# EAGLE design itrope-Hive-pairs (EAGLE 7.7.0)

## Sheet 1 of 9
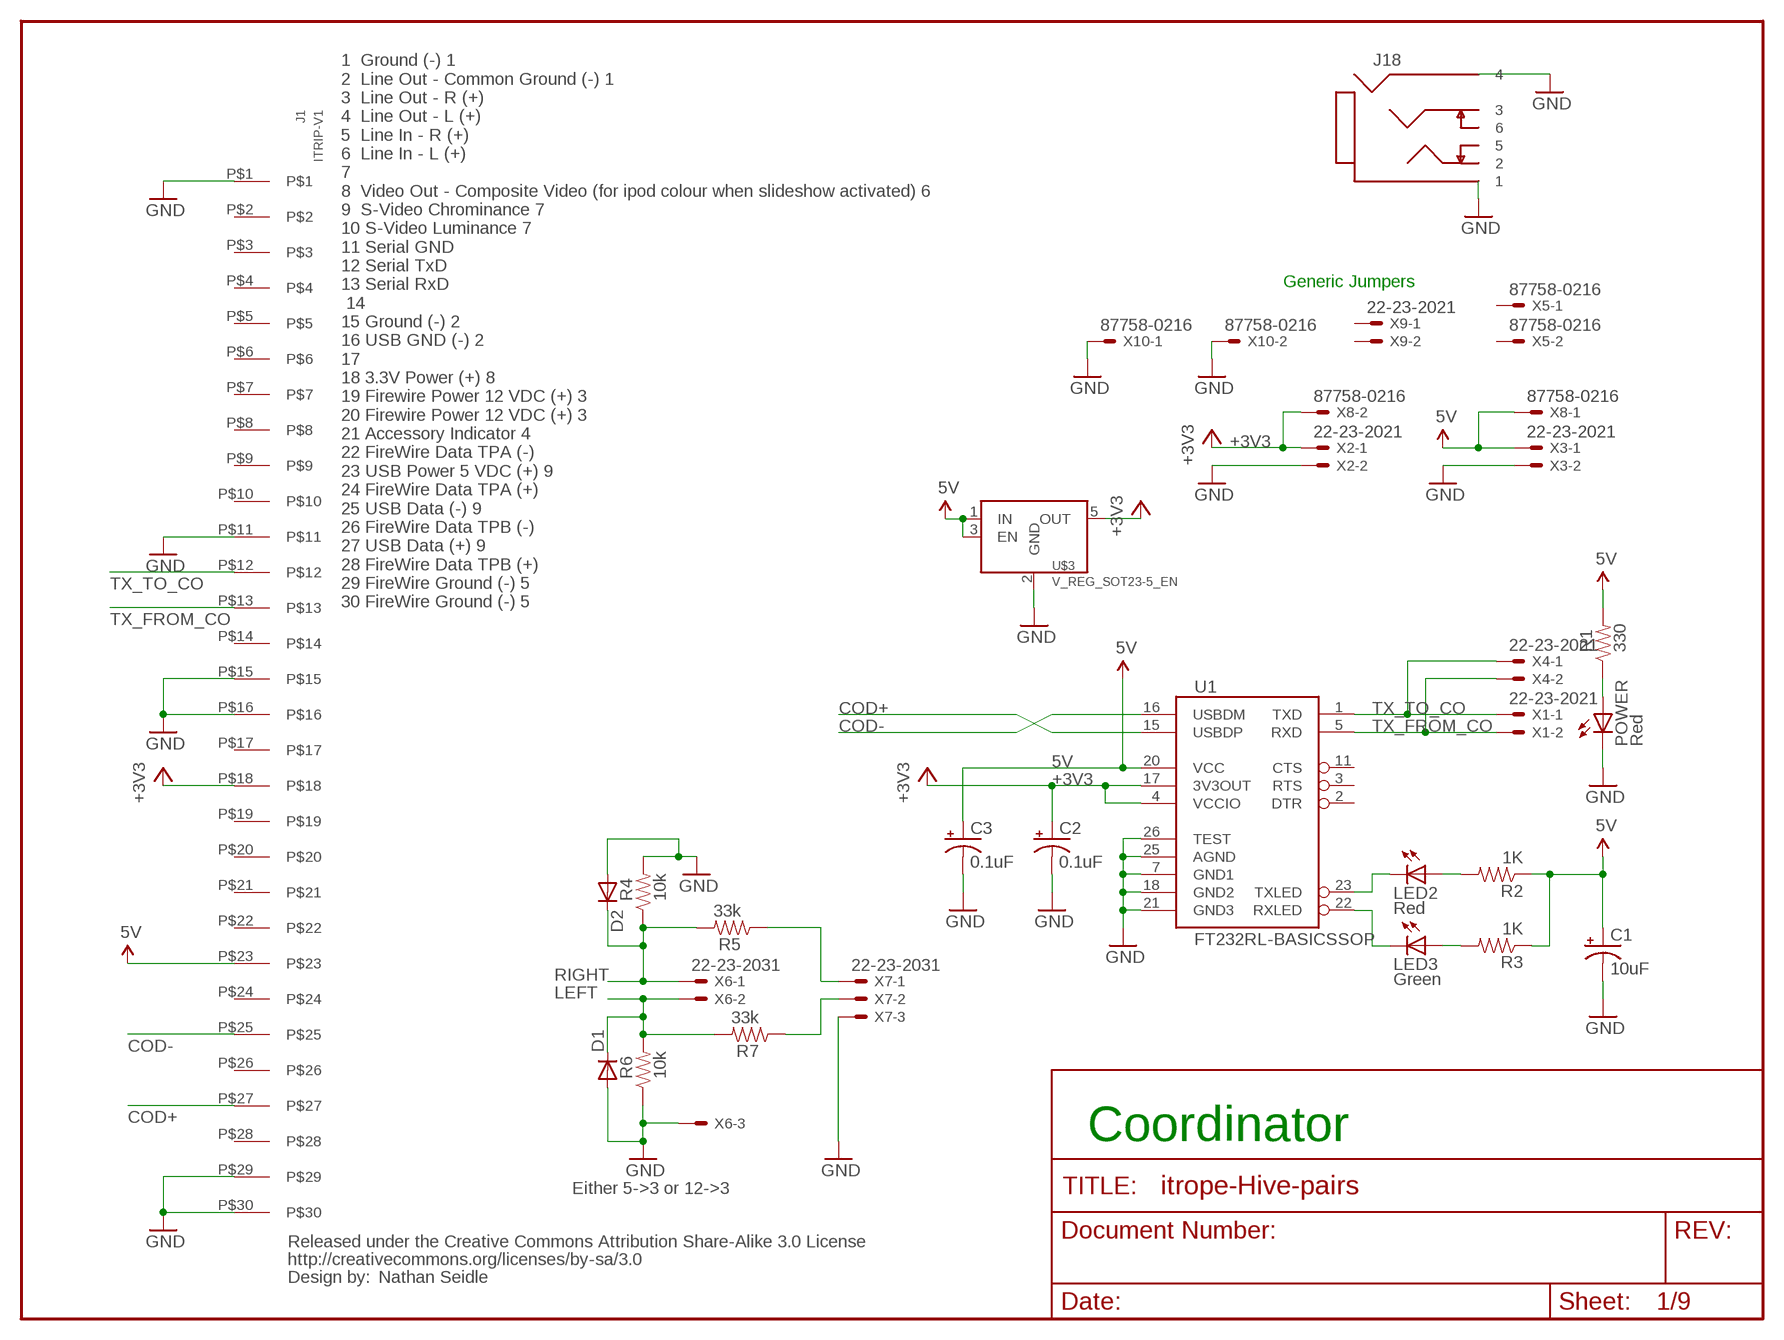
[diagram p0: schematic, sheet 1]

### Parts
C1  10uF  CPOL-USE2.5-5  [E2,5-5]
C2  0.1uF  CPOL-USE2.5-5  [E2,5-5]
C3  0.1uF  CPOL-USE2.5-5  [E2,5-5]
D1  DIODESOD  [SOD-323]
D2  DIODESOD  [SOD-323]
J1  ITRIP-V1  [30PINEDGE+ITRIP]
J18  JACK-PHONO-4COND-SW-C  [CUI-SJ-4351-CUSTOM]
LED2  Red  LED0603  [LED-0603]
LED3  Green  LED0603  [LED-0603]
POWER  Red  LED0603  [LED-0603]
R1  330  RESISTOR0402  [C0402]
R2  1K  RESISTOR0402  [C0402]
R3  1K  RESISTOR0402  [C0402]
R4  10k  RESISTOR0402  [C0402]
R5  33k  RESISTOR0402  [C0402]
R6  10k  RESISTOR0402  [C0402]
R7  33k  RESISTOR0402  [C0402]
U1  FT232RL-BASICSSOP  [SSOP28DB]
U$3  V_REG_SOT23-5_EN  [SOT23-5]
U$9  CREATIVE_COMMONS  [CREATIVE_COMMONS]
X1  22-23-2021  [22-23-2021]
X2  22-23-2021  [22-23-2021]
X3  22-23-2021  [22-23-2021]
X4  22-23-2021  [22-23-2021]
X5  87758-0216  [87758-0216]
X6  22-23-2031  [22-23-2031]
X7  22-23-2031  [22-23-2031]
X8  87758-0216  [87758-0216]
X9  22-23-2021  [22-23-2021]
X10  87758-0216  [87758-0216]

### Nets
5V [vcc]: C1.+ C3.+ J1.P$23 R1.2 R2.1 R3.1 U1.20(VCC) U$3.1(IN) U$3.3(EN) X3.1 X8.1 ; also sheet 2,3,4,5,6,7,8,9
+3V3: C2.+ J1.P$18 U1.4(VCCIO) U1.17(3V3OUT) U$3.5(OUT) X2.1 X8.2 ; also sheet 2,3,4,5,6,7,8,9
COD+: J1.P$27 U1.15(USBDP)
COD-: J1.P$25 U1.16(USBDM)
GND [vcc]: C1.- C2.- C3.- D1.2(A) D2.2(A) J1.P$1 J1.P$11 J1.P$15 J1.P$16 J1.P$29 J1.P$30 J18.1 J18.4 POWER.C R4.2 R6.1 U1.7(GND1) U1.18(GND2) U1.21(GND3) U1.25(AGND) U1.26(TEST) U$3.2(GND) X2.2 X3.2 X6.3 X7.3 X10.1 X10.2 ; also sheet 2,3,4,5,6,7,8,9
LEFT: D1.1(C) R6.2 R7.2 X6.2 ; also sheet 2,3,4,5,6,7,8,9
N$1: POWER.A R1.1
N$2: R7.1 X7.2
N$3: LED2.A R2.2
N$4: LED3.A R3.2
N$5: R5.1 X7.1
RIGHT: D2.1(C) R4.1 R5.2 X6.1 ; also sheet 2,3,4,5,6,7,8,9
RXLED: LED3.C U1.22(RXLED)
TX_FROM_CO: J1.P$13 U1.5(RXD) X1.2 X4.2 ; also sheet 2
TX_TO_CO: J1.P$12 U1.1(TXD) X1.1 X4.1 ; also sheet 2
TXLED: LED2.C U1.23(TXLED)
Unconnected: J1.P$2 J1.P$3 J1.P$4 J1.P$5 J1.P$6 J1.P$7 J1.P$8 J1.P$9 J1.P$10 J1.P$14 J1.P$17 J1.P$19 J1.P$20 J1.P$21 J1.P$22 J1.P$24 J1.P$26 J1.P$28 J18.2 J18.3 J18.5 J18.6 U1.2(DTR) U1.3(RTS) U1.11(CTS) X5.1 X5.2 X9.1 X9.2

### Notes on the sheet
- Generic Jumpers
- 1  Ground (-) 1
  2  Line Out - Common Ground (-) 1
  3  Line Out - R (+)
  4  Line Out - L (+)
  5  Line In - R (+)
  6  Line In - L (+)
  7
  8  Video Out - Composite Video (for ipod colour when slideshow activated) 6
  9  S-Video Chrominance 7
  10 S-Video Luminance 7
  11 Serial GND
  12 Serial TxD
  13 Serial RxD
   14
  15 Ground (-) 2
  16 USB GND (-) 2
  17
  18 3.3V Power (+) 8
  19 Firewire Power 12 VDC (+) 3
  20 Firewire Power 12 VDC (+) 3
  21 Accessory Indicator 4
  22 FireWire Data TPA (-)
  23 USB Power 5 VDC (+) 9
  24 FireWire Data TPA (+)
  25 USB Data (-) 9
  26 FireWire Data TPB (-)
  27 USB Data (+) 9
  28 FireWire Data TPB (+)
  29 FireWire Ground (-) 5
  30 FireWire Ground (-) 5
- Coordinator
- Either 5->3 or 12->3
- Nathan Seidle

## Sheet 2 of 9
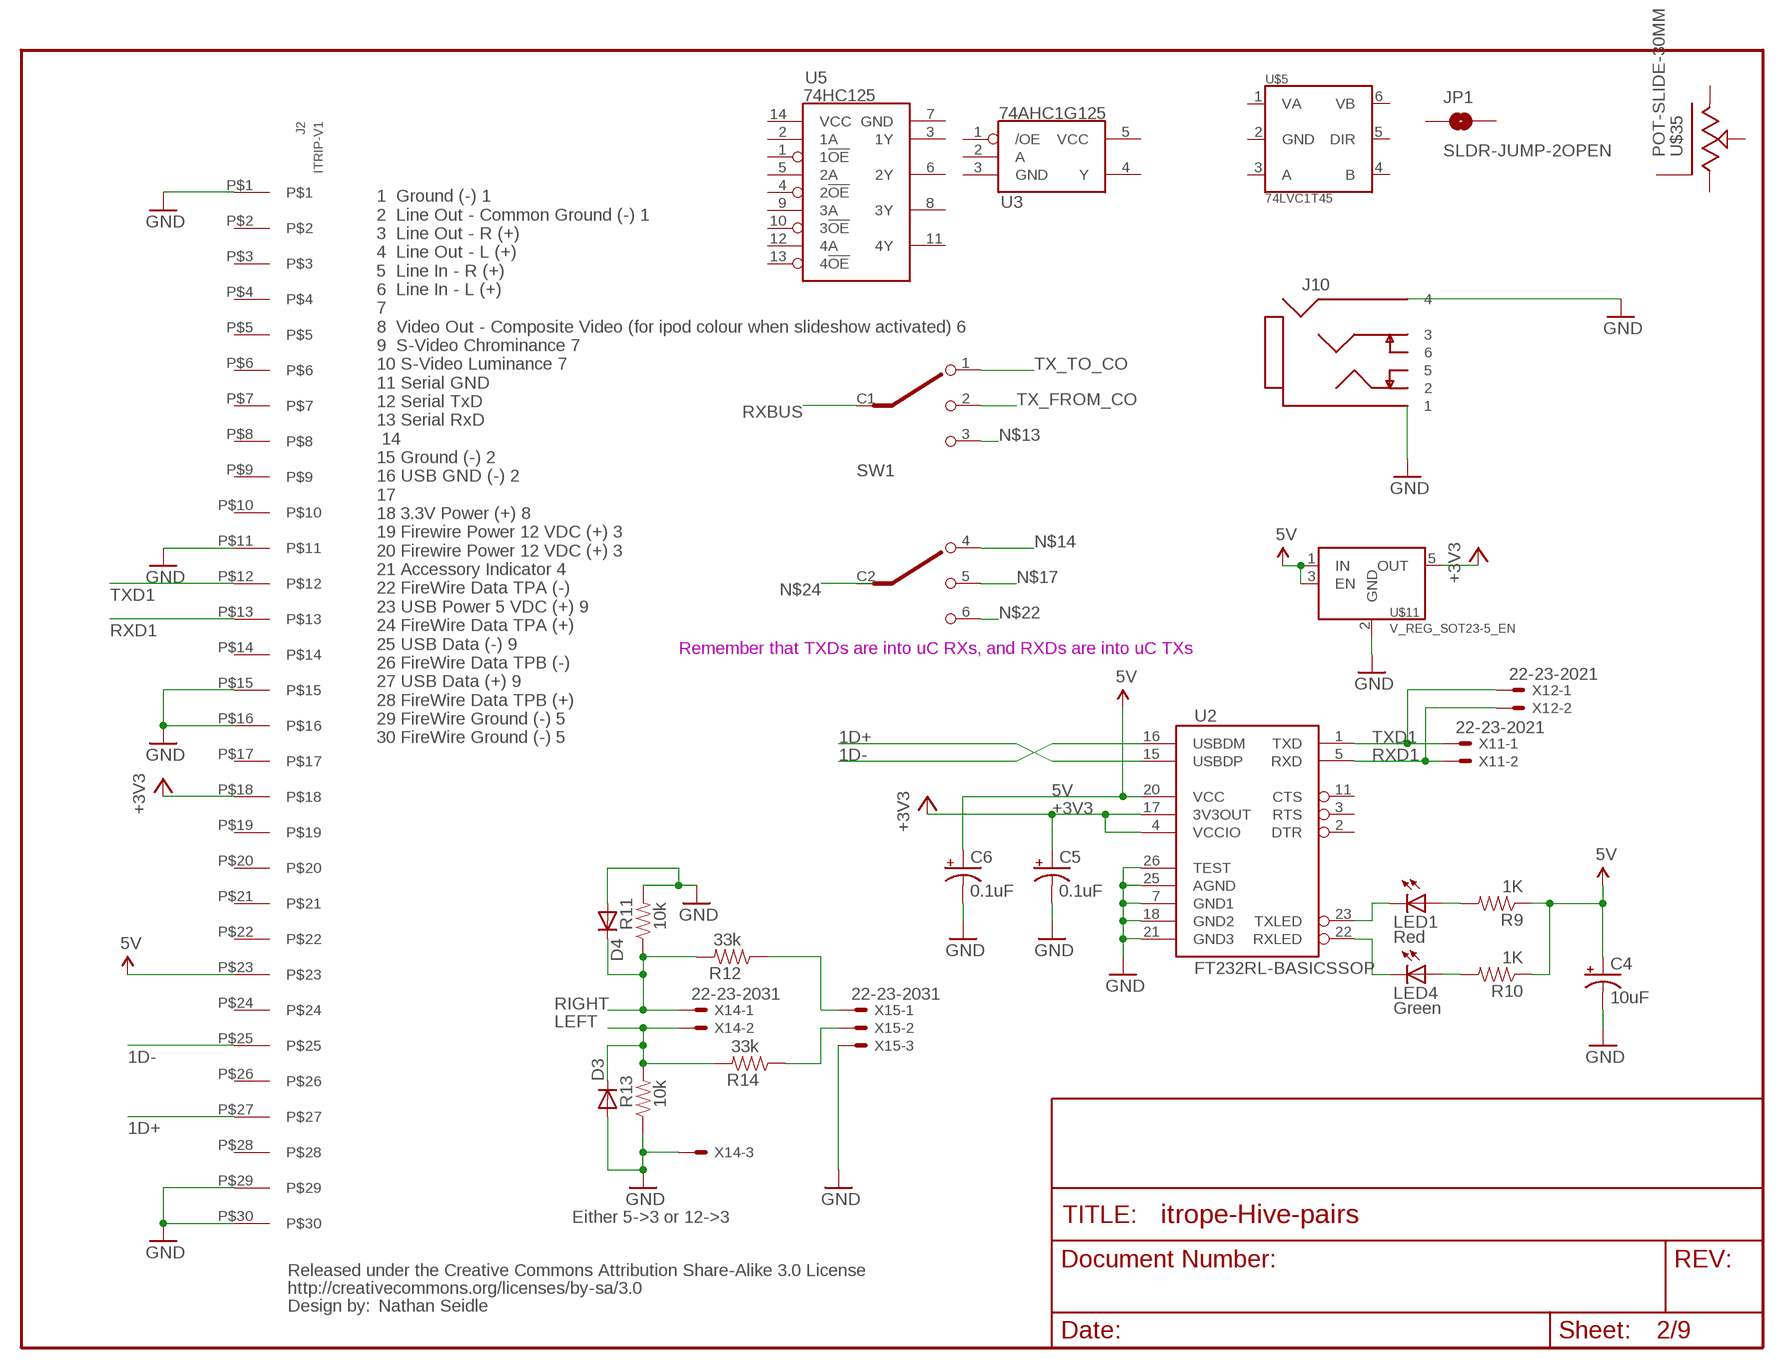
[diagram p1: schematic, sheet 2]

### Parts
C4  10uF  CPOL-USE2.5-5  [E2,5-5]
C5  0.1uF  CPOL-USE2.5-5  [E2,5-5]
C6  0.1uF  CPOL-USE2.5-5  [E2,5-5]
D3  DIODESOD  [SOD-323]
D4  DIODESOD  [SOD-323]
J2  ITRIP-V1  [30PINEDGE+ITRIP]
J10  JACK-PHONO-4COND-SW-C  [CUI-SJ-4351-CUSTOM]
JP1  SLDR-JUMP-2OPEN  [PAD-JUMPER-2-NO_YES_SILK]
LED1  Red  LED0603  [LED-0603]
LED4  Green  LED0603  [LED-0603]
R9  1K  RESISTOR0402  [C0402]
R10  1K  RESISTOR0402  [C0402]
R11  10k  RESISTOR0402  [C0402]
R12  33k  RESISTOR0402  [C0402]
R13  10k  RESISTOR0402  [C0402]
R14  33k  RESISTOR0402  [C0402]
SW1  SWITCH-SLIDE-DP3TAYZ0203  [SWITCH-CK-AYZ0203]
U2  FT232RL-BASICSSOP  [SSOP28DB]
U3  74AHC1G125  [SOT23-5]
U5  74HC125  [SOIC14]
U$5  74LVC1T45  [SC70-6]
U$7  CREATIVE_COMMONS  [CREATIVE_COMMONS]
U$11  V_REG_SOT23-5_EN  [SOT23-5]
U$35  POT-SLIDE-30MM  [POT-SLIDE-30MM]
X11  22-23-2021  [22-23-2021]
X12  22-23-2021  [22-23-2021]
X14  22-23-2031  [22-23-2031]
X15  22-23-2031  [22-23-2031]

### Nets
1D+: J2.P$27 U2.15(USBDP)
1D-: J2.P$25 U2.16(USBDM)
5V [vcc]: C4.+ C6.+ J2.P$23 R9.1 R10.1 U2.20(VCC) U$11.1(IN) U$11.3(EN) ; also sheet 1,3,4,5,6,7,8,9
+3V3: C5.+ J2.P$18 U2.4(VCCIO) U2.17(3V3OUT) U$11.5(OUT) ; also sheet 1,3,4,5,6,7,8,9
GND [vcc]: C4.- C5.- C6.- D3.2(A) D4.2(A) J2.P$1 J2.P$11 J2.P$15 J2.P$16 J2.P$29 J2.P$30 J10.1 J10.4 R11.2 R13.1 U2.7(GND1) U2.18(GND2) U2.21(GND3) U2.25(AGND) U2.26(TEST) U$11.2(GND) X14.3 X15.3 ; also sheet 1,3,4,5,6,7,8,9
LEFT: D3.1(C) R13.2 R14.2 X14.2 ; also sheet 1,3,4,5,6,7,8,9
N$8: LED1.A R9.2
N$9: LED4.A R10.2
N$10: R14.1 X15.2
N$11: R12.1 X15.1
N$13: SW1.3
N$14: SW1.4
N$17: SW1.5
N$22: SW1.6
RIGHT: D4.1(C) R11.1 R12.2 X14.1 ; also sheet 1,3,4,5,6,7,8,9
RXBUS: SW1.C1
RXD1: J2.P$13 U2.5(RXD) X11.2 X12.2 ; also sheet 3
RXLED1: LED4.C U2.22(RXLED)
TX_FROM_CO: SW1.2 ; also sheet 1
TX_TO_CO: SW1.1 ; also sheet 1
TXD1: J2.P$12 U2.1(TXD) X11.1 X12.1 ; also sheet 3
TXLED1: LED1.C U2.23(TXLED)
Unconnected: J2.P$2 J2.P$3 J2.P$4 J2.P$5 J2.P$6 J2.P$7 J2.P$8 J2.P$9 J2.P$10 J2.P$14 J2.P$17 J2.P$19 J2.P$20 J2.P$21 J2.P$22 J2.P$24 J2.P$26 J2.P$28 J10.2 J10.3 J10.5 J10.6 JP1.1 JP1.2 SW1.C2 U2.2(DTR) U2.3(RTS) U2.11(CTS) U3.1(/OE) U3.2(A) U3.3(GND) U3.4(Y) U3.5(VCC) U5.1(1!OE) U5.2(1A) U5.3(1Y) U5.4(2!OE) U5.5(2A) U5.6(2Y) U5.7(GND) U5.8(3Y) U5.9(3A) U5.10(3!OE) U5.11(4Y) U5.12(4A) U5.13(4!OE) U5.14(VCC) U$5.1(VA) U$5.2(GND) U$5.3(A) U$5.4(B) U$5.5(DIR) U$5.6(VB) U$35.1 U$35.2 U$35.3 U$35.P$4(CASE) U$35.P$5(CASE) U$35.P$6(CASE) U$35.P$7(CASE)

### Notes on the sheet
- Remember that TXDs are into uC RXs, and RXDs are into uC TXs
- 1  Ground (-) 1
  2  Line Out - Common Ground (-) 1
  3  Line Out - R (+)
  4  Line Out - L (+)
  5  Line In - R (+)
  6  Line In - L (+)
  7
  8  Video Out - Composite Video (for ipod colour when slideshow activated) 6
  9  S-Video Chrominance 7
  10 S-Video Luminance 7
  11 Serial GND
  12 Serial TxD
  13 Serial RxD
   14
  15 Ground (-) 2
  16 USB GND (-) 2
  17
  18 3.3V Power (+) 8
  19 Firewire Power 12 VDC (+) 3
  20 Firewire Power 12 VDC (+) 3
  21 Accessory Indicator 4
  22 FireWire Data TPA (-)
  23 USB Power 5 VDC (+) 9
  24 FireWire Data TPA (+)
  25 USB Data (-) 9
  26 FireWire Data TPB (-)
  27 USB Data (+) 9
  28 FireWire Data TPB (+)
  29 FireWire Ground (-) 5
  30 FireWire Ground (-) 5
- Either 5->3 or 12->3
- Nathan Seidle

## Sheet 3 of 9
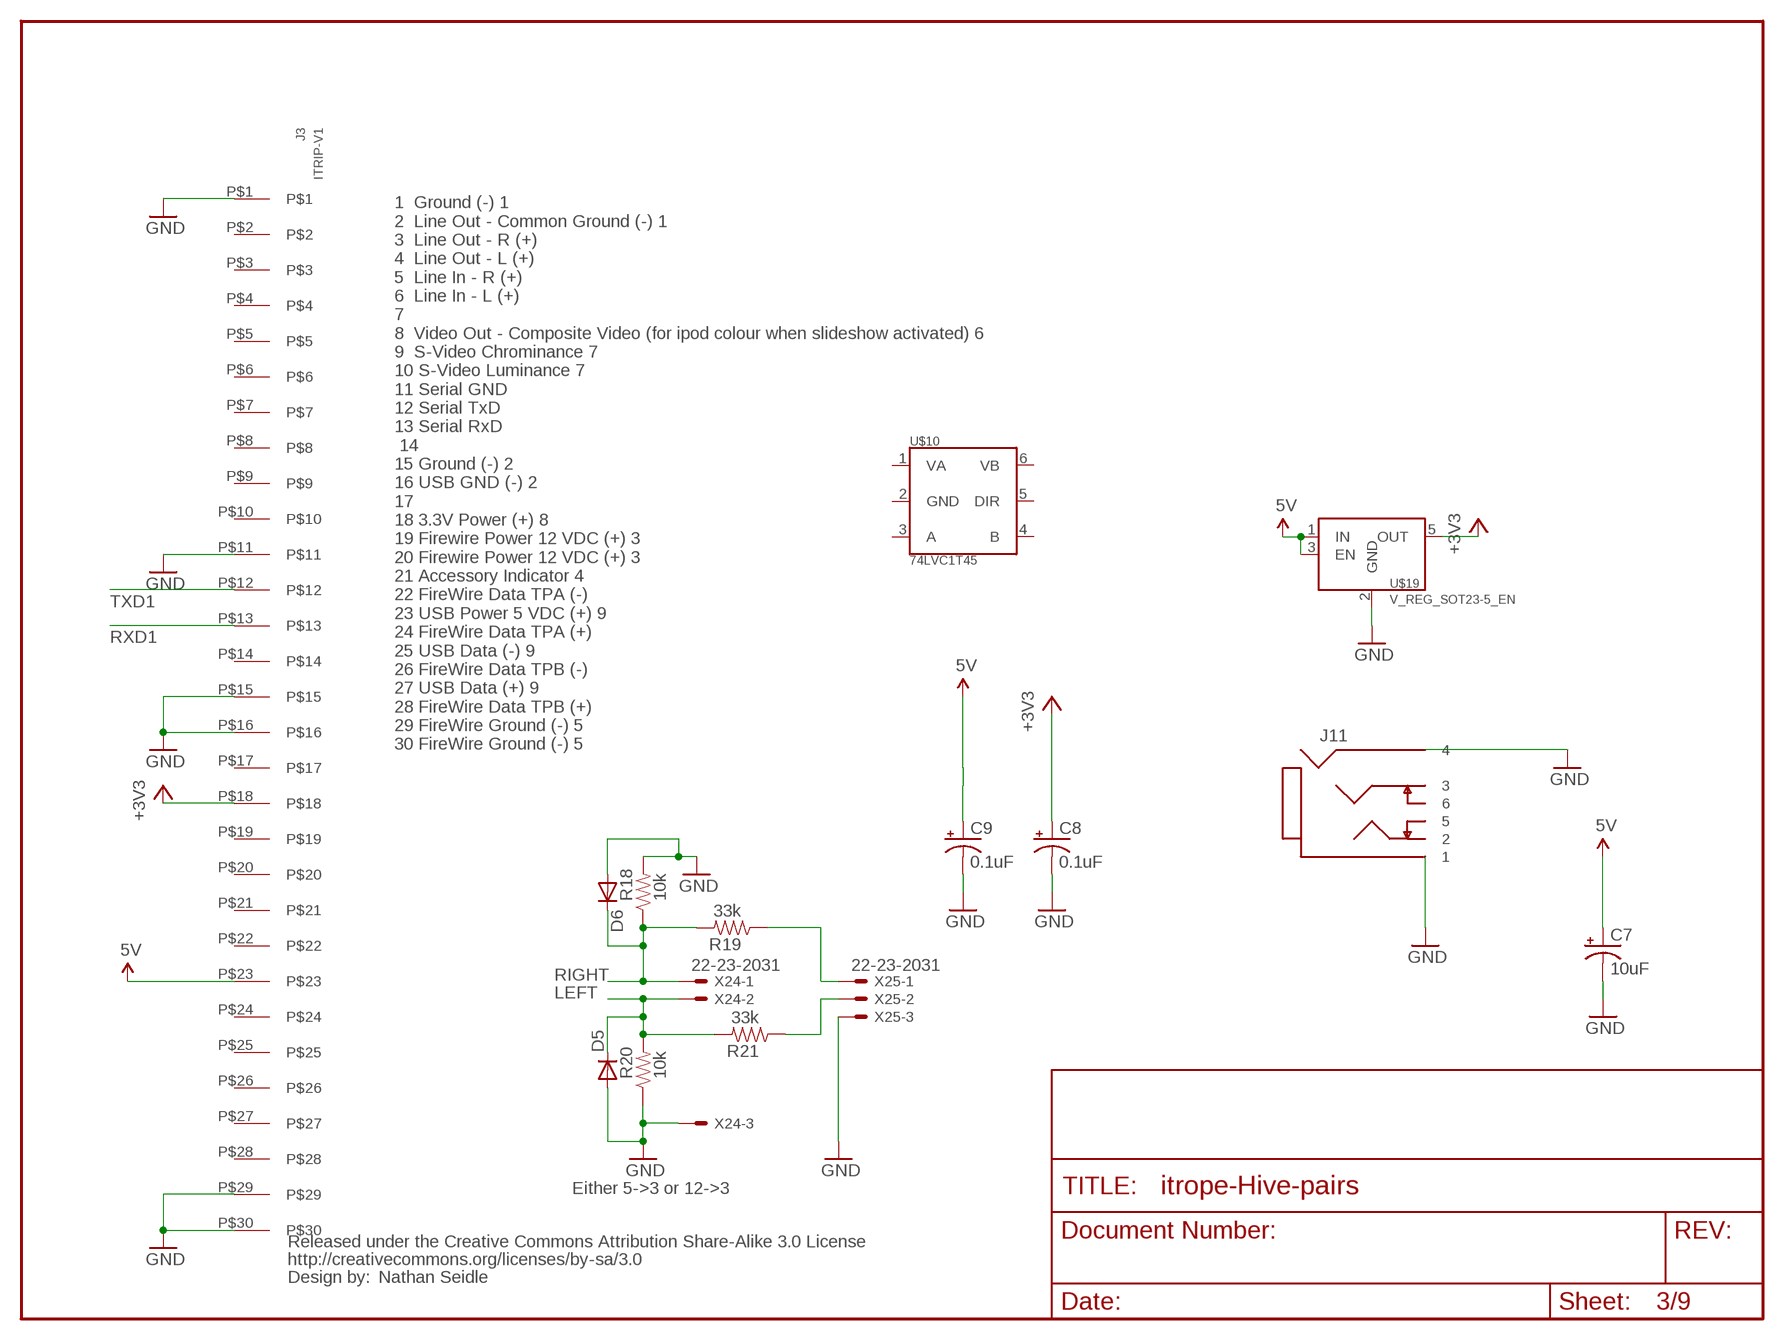
[diagram p2: schematic, sheet 3]

### Parts
C7  10uF  CPOL-USE2.5-5  [E2,5-5]
C8  0.1uF  CPOL-USE2.5-5  [E2,5-5]
C9  0.1uF  CPOL-USE2.5-5  [E2,5-5]
D5  DIODESOD  [SOD-323]
D6  DIODESOD  [SOD-323]
J3  ITRIP-V1  [30PINEDGE+ITRIP]
J11  JACK-PHONO-4COND-SW-C  [CUI-SJ-4351-CUSTOM]
R18  10k  RESISTOR0402  [C0402]
R19  33k  RESISTOR0402  [C0402]
R20  10k  RESISTOR0402  [C0402]
R21  33k  RESISTOR0402  [C0402]
U$10  74LVC1T45  [SC70-6]
U$16  CREATIVE_COMMONS  [CREATIVE_COMMONS]
U$19  V_REG_SOT23-5_EN  [SOT23-5]
X24  22-23-2031  [22-23-2031]
X25  22-23-2031  [22-23-2031]

### Nets
5V [vcc]: C7.+ C9.+ J3.P$23 U$19.1(IN) U$19.3(EN) ; also sheet 1,2,4,5,6,7,8,9
+3V3: C8.+ J3.P$18 U$19.5(OUT) ; also sheet 1,2,4,5,6,7,8,9
GND [vcc]: C7.- C8.- C9.- D5.2(A) D6.2(A) J3.P$1 J3.P$11 J3.P$15 J3.P$16 J3.P$29 J3.P$30 J11.1 J11.4 R18.2 R20.1 U$19.2(GND) X24.3 X25.3 ; also sheet 1,2,4,5,6,7,8,9
LEFT: D5.1(C) R20.2 R21.2 X24.2 ; also sheet 1,2,4,5,6,7,8,9
N$15: R21.1 X25.2
N$16: R19.1 X25.1
RIGHT: D6.1(C) R18.1 R19.2 X24.1 ; also sheet 1,2,4,5,6,7,8,9
RXD1: J3.P$13 ; also sheet 2
TXD1: J3.P$12 ; also sheet 2
Unconnected: J3.P$2 J3.P$3 J3.P$4 J3.P$5 J3.P$6 J3.P$7 J3.P$8 J3.P$9 J3.P$10 J3.P$14 J3.P$17 J3.P$19 J3.P$20 J3.P$21 J3.P$22 J3.P$24 J3.P$25 J3.P$26 J3.P$27 J3.P$28 J11.2 J11.3 J11.5 J11.6 U$10.1(VA) U$10.2(GND) U$10.3(A) U$10.4(B) U$10.5(DIR) U$10.6(VB)

### Notes on the sheet
- 1  Ground (-) 1
  2  Line Out - Common Ground (-) 1
  3  Line Out - R (+)
  4  Line Out - L (+)
  5  Line In - R (+)
  6  Line In - L (+)
  7
  8  Video Out - Composite Video (for ipod colour when slideshow activated) 6
  9  S-Video Chrominance 7
  10 S-Video Luminance 7
  11 Serial GND
  12 Serial TxD
  13 Serial RxD
   14
  15 Ground (-) 2
  16 USB GND (-) 2
  17
  18 3.3V Power (+) 8
  19 Firewire Power 12 VDC (+) 3
  20 Firewire Power 12 VDC (+) 3
  21 Accessory Indicator 4
  22 FireWire Data TPA (-)
  23 USB Power 5 VDC (+) 9
  24 FireWire Data TPA (+)
  25 USB Data (-) 9
  26 FireWire Data TPB (-)
  27 USB Data (+) 9
  28 FireWire Data TPB (+)
  29 FireWire Ground (-) 5
  30 FireWire Ground (-) 5
- Either 5->3 or 12->3
- Nathan Seidle

## Sheet 4 of 9
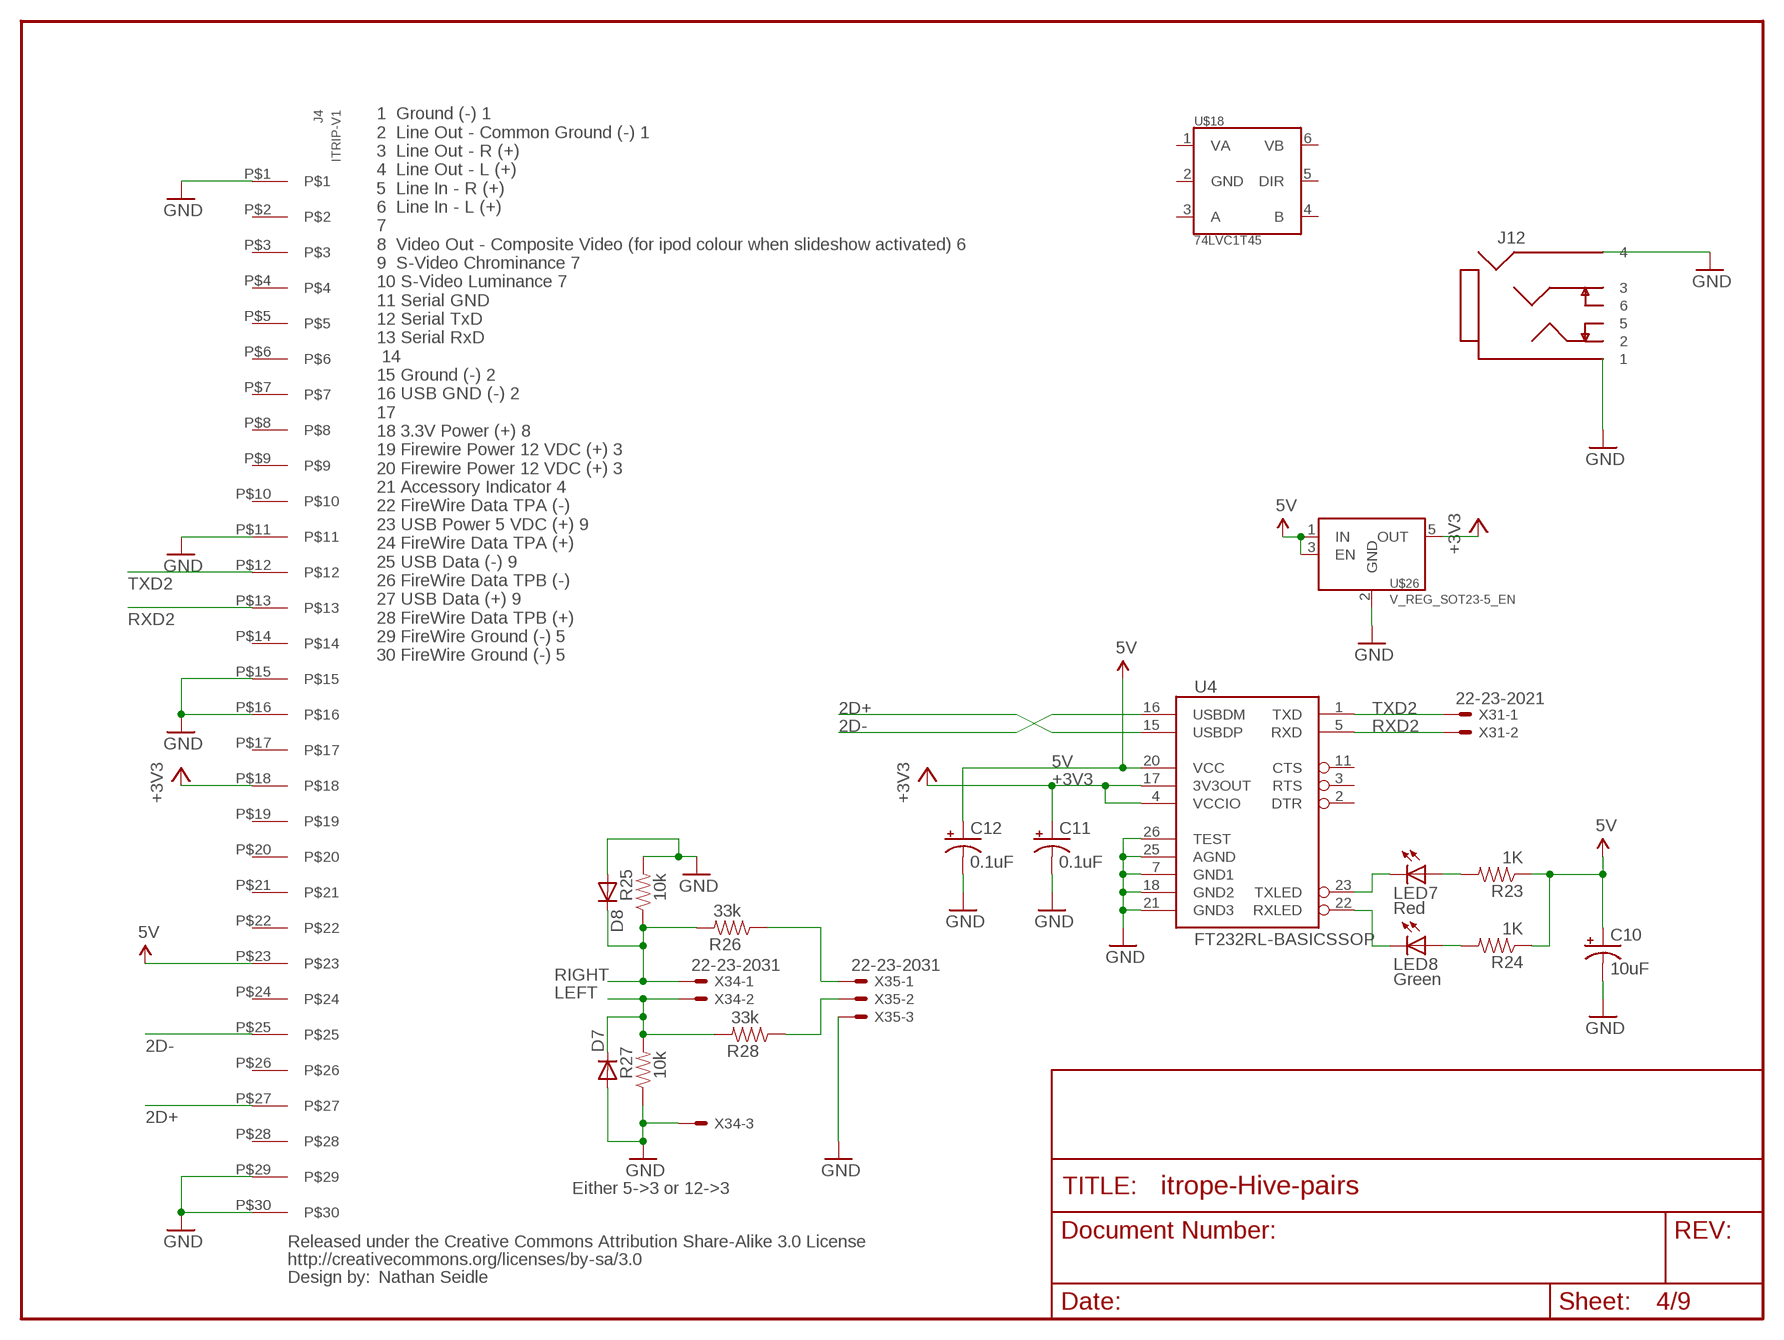
[diagram p3: schematic, sheet 4]

### Parts
C10  10uF  CPOL-USE2.5-5  [E2,5-5]
C11  0.1uF  CPOL-USE2.5-5  [E2,5-5]
C12  0.1uF  CPOL-USE2.5-5  [E2,5-5]
D7  DIODESOD  [SOD-323]
D8  DIODESOD  [SOD-323]
J4  ITRIP-V1  [30PINEDGE+ITRIP]
J12  JACK-PHONO-4COND-SW-C  [CUI-SJ-4351-CUSTOM]
LED7  Red  LED0603  [LED-0603]
LED8  Green  LED0603  [LED-0603]
R23  1K  RESISTOR0402  [C0402]
R24  1K  RESISTOR0402  [C0402]
R25  10k  RESISTOR0402  [C0402]
R26  33k  RESISTOR0402  [C0402]
R27  10k  RESISTOR0402  [C0402]
R28  33k  RESISTOR0402  [C0402]
U4  FT232RL-BASICSSOP  [SSOP28DB]
U$18  74LVC1T45  [SC70-6]
U$23  CREATIVE_COMMONS  [CREATIVE_COMMONS]
U$26  V_REG_SOT23-5_EN  [SOT23-5]
X31  22-23-2021  [22-23-2021]
X34  22-23-2031  [22-23-2031]
X35  22-23-2031  [22-23-2031]

### Nets
2D+: J4.P$27 U4.15(USBDP)
2D-: J4.P$25 U4.16(USBDM)
5V [vcc]: C10.+ C12.+ J4.P$23 R23.1 R24.1 U4.20(VCC) U$26.1(IN) U$26.3(EN) ; also sheet 1,2,3,5,6,7,8,9
+3V3: C11.+ J4.P$18 U4.4(VCCIO) U4.17(3V3OUT) U$26.5(OUT) ; also sheet 1,2,3,5,6,7,8,9
GND [vcc]: C10.- C11.- C12.- D7.2(A) D8.2(A) J4.P$1 J4.P$11 J4.P$15 J4.P$16 J4.P$29 J4.P$30 J12.1 J12.4 R25.2 R27.1 U4.7(GND1) U4.18(GND2) U4.21(GND3) U4.25(AGND) U4.26(TEST) U$26.2(GND) X34.3 X35.3 ; also sheet 1,2,3,5,6,7,8,9
LEFT: D7.1(C) R27.2 R28.2 X34.2 ; also sheet 1,2,3,5,6,7,8,9
N$18: LED7.A R23.2
N$19: LED8.A R24.2
N$20: R28.1 X35.2
N$21: R26.1 X35.1
RIGHT: D8.1(C) R25.1 R26.2 X34.1 ; also sheet 1,2,3,5,6,7,8,9
RXD2: J4.P$13 U4.5(RXD) X31.2 ; also sheet 5
RXLED3: LED8.C U4.22(RXLED)
TXD2: J4.P$12 U4.1(TXD) X31.1 ; also sheet 5
TXLED3: LED7.C U4.23(TXLED)
Unconnected: J4.P$2 J4.P$3 J4.P$4 J4.P$5 J4.P$6 J4.P$7 J4.P$8 J4.P$9 J4.P$10 J4.P$14 J4.P$17 J4.P$19 J4.P$20 J4.P$21 J4.P$22 J4.P$24 J4.P$26 J4.P$28 J12.2 J12.3 J12.5 J12.6 U4.2(DTR) U4.3(RTS) U4.11(CTS) U$18.1(VA) U$18.2(GND) U$18.3(A) U$18.4(B) U$18.5(DIR) U$18.6(VB)

### Notes on the sheet
- 1  Ground (-) 1
  2  Line Out - Common Ground (-) 1
  3  Line Out - R (+)
  4  Line Out - L (+)
  5  Line In - R (+)
  6  Line In - L (+)
  7
  8  Video Out - Composite Video (for ipod colour when slideshow activated) 6
  9  S-Video Chrominance 7
  10 S-Video Luminance 7
  11 Serial GND
  12 Serial TxD
  13 Serial RxD
   14
  15 Ground (-) 2
  16 USB GND (-) 2
  17
  18 3.3V Power (+) 8
  19 Firewire Power 12 VDC (+) 3
  20 Firewire Power 12 VDC (+) 3
  21 Accessory Indicator 4
  22 FireWire Data TPA (-)
  23 USB Power 5 VDC (+) 9
  24 FireWire Data TPA (+)
  25 USB Data (-) 9
  26 FireWire Data TPB (-)
  27 USB Data (+) 9
  28 FireWire Data TPB (+)
  29 FireWire Ground (-) 5
  30 FireWire Ground (-) 5
- Either 5->3 or 12->3
- Nathan Seidle

## Sheet 5 of 9
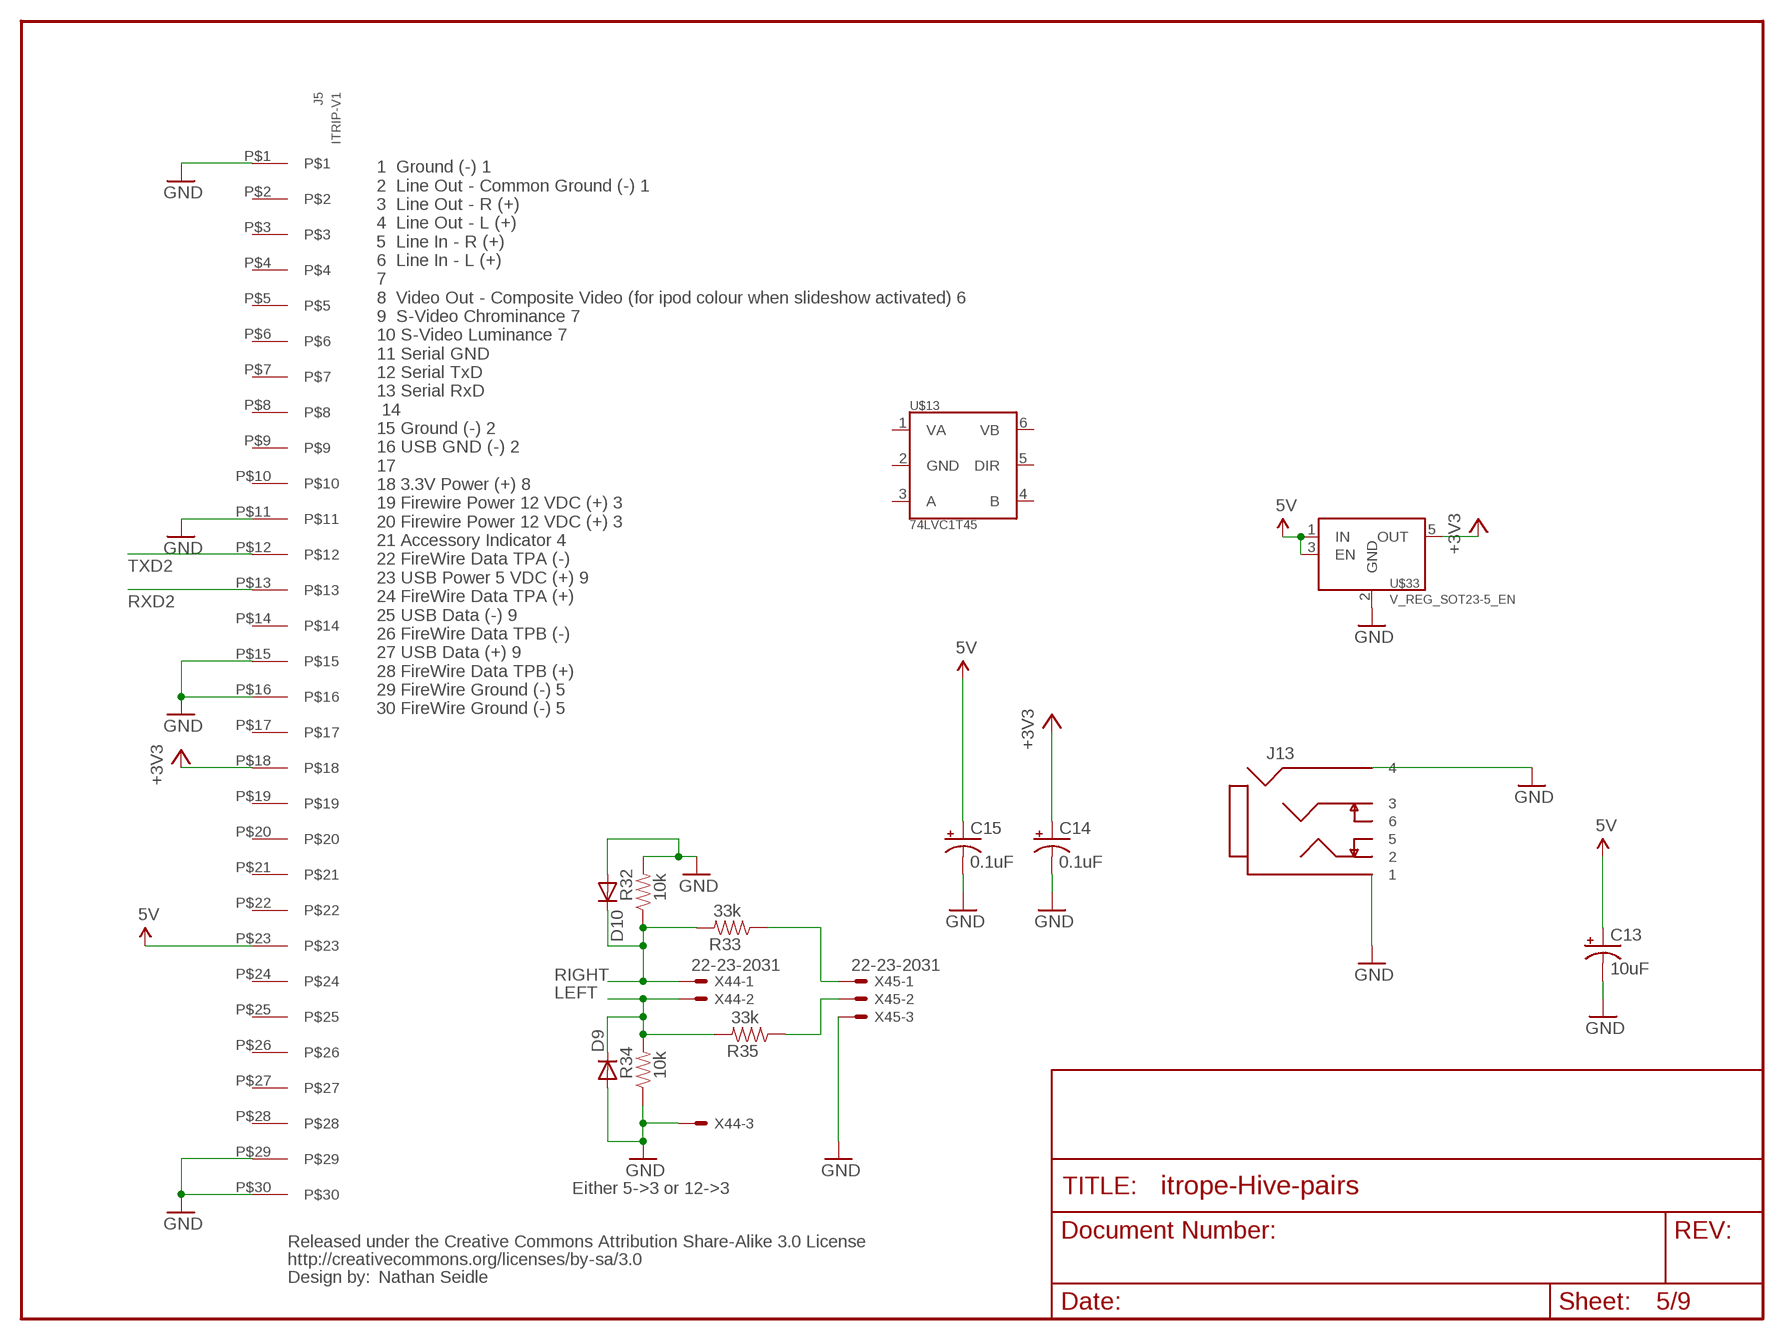
[diagram p4: schematic, sheet 5]

### Parts
C13  10uF  CPOL-USE2.5-5  [E2,5-5]
C14  0.1uF  CPOL-USE2.5-5  [E2,5-5]
C15  0.1uF  CPOL-USE2.5-5  [E2,5-5]
D9  DIODESOD  [SOD-323]
D10  DIODESOD  [SOD-323]
J5  ITRIP-V1  [30PINEDGE+ITRIP]
J13  JACK-PHONO-4COND-SW-C  [CUI-SJ-4351-CUSTOM]
R32  10k  RESISTOR0402  [C0402]
R33  33k  RESISTOR0402  [C0402]
R34  10k  RESISTOR0402  [C0402]
R35  33k  RESISTOR0402  [C0402]
U$13  74LVC1T45  [SC70-6]
U$30  CREATIVE_COMMONS  [CREATIVE_COMMONS]
U$33  V_REG_SOT23-5_EN  [SOT23-5]
X44  22-23-2031  [22-23-2031]
X45  22-23-2031  [22-23-2031]

### Nets
5V [vcc]: C13.+ C15.+ J5.P$23 U$33.1(IN) U$33.3(EN) ; also sheet 1,2,3,4,6,7,8,9
+3V3: C14.+ J5.P$18 U$33.5(OUT) ; also sheet 1,2,3,4,6,7,8,9
GND [vcc]: C13.- C14.- C15.- D9.2(A) D10.2(A) J5.P$1 J5.P$11 J5.P$15 J5.P$16 J5.P$29 J5.P$30 J13.1 J13.4 R32.2 R34.1 U$33.2(GND) X44.3 X45.3 ; also sheet 1,2,3,4,6,7,8,9
LEFT: D9.1(C) R34.2 R35.2 X44.2 ; also sheet 1,2,3,4,6,7,8,9
N$25: R35.1 X45.2
N$26: R33.1 X45.1
RIGHT: D10.1(C) R32.1 R33.2 X44.1 ; also sheet 1,2,3,4,6,7,8,9
RXD2: J5.P$13 ; also sheet 4
TXD2: J5.P$12 ; also sheet 4
Unconnected: J5.P$2 J5.P$3 J5.P$4 J5.P$5 J5.P$6 J5.P$7 J5.P$8 J5.P$9 J5.P$10 J5.P$14 J5.P$17 J5.P$19 J5.P$20 J5.P$21 J5.P$22 J5.P$24 J5.P$25 J5.P$26 J5.P$27 J5.P$28 J13.2 J13.3 J13.5 J13.6 U$13.1(VA) U$13.2(GND) U$13.3(A) U$13.4(B) U$13.5(DIR) U$13.6(VB)

### Notes on the sheet
- 1  Ground (-) 1
  2  Line Out - Common Ground (-) 1
  3  Line Out - R (+)
  4  Line Out - L (+)
  5  Line In - R (+)
  6  Line In - L (+)
  7
  8  Video Out - Composite Video (for ipod colour when slideshow activated) 6
  9  S-Video Chrominance 7
  10 S-Video Luminance 7
  11 Serial GND
  12 Serial TxD
  13 Serial RxD
   14
  15 Ground (-) 2
  16 USB GND (-) 2
  17
  18 3.3V Power (+) 8
  19 Firewire Power 12 VDC (+) 3
  20 Firewire Power 12 VDC (+) 3
  21 Accessory Indicator 4
  22 FireWire Data TPA (-)
  23 USB Power 5 VDC (+) 9
  24 FireWire Data TPA (+)
  25 USB Data (-) 9
  26 FireWire Data TPB (-)
  27 USB Data (+) 9
  28 FireWire Data TPB (+)
  29 FireWire Ground (-) 5
  30 FireWire Ground (-) 5
- Either 5->3 or 12->3
- Nathan Seidle

## Sheet 6 of 9
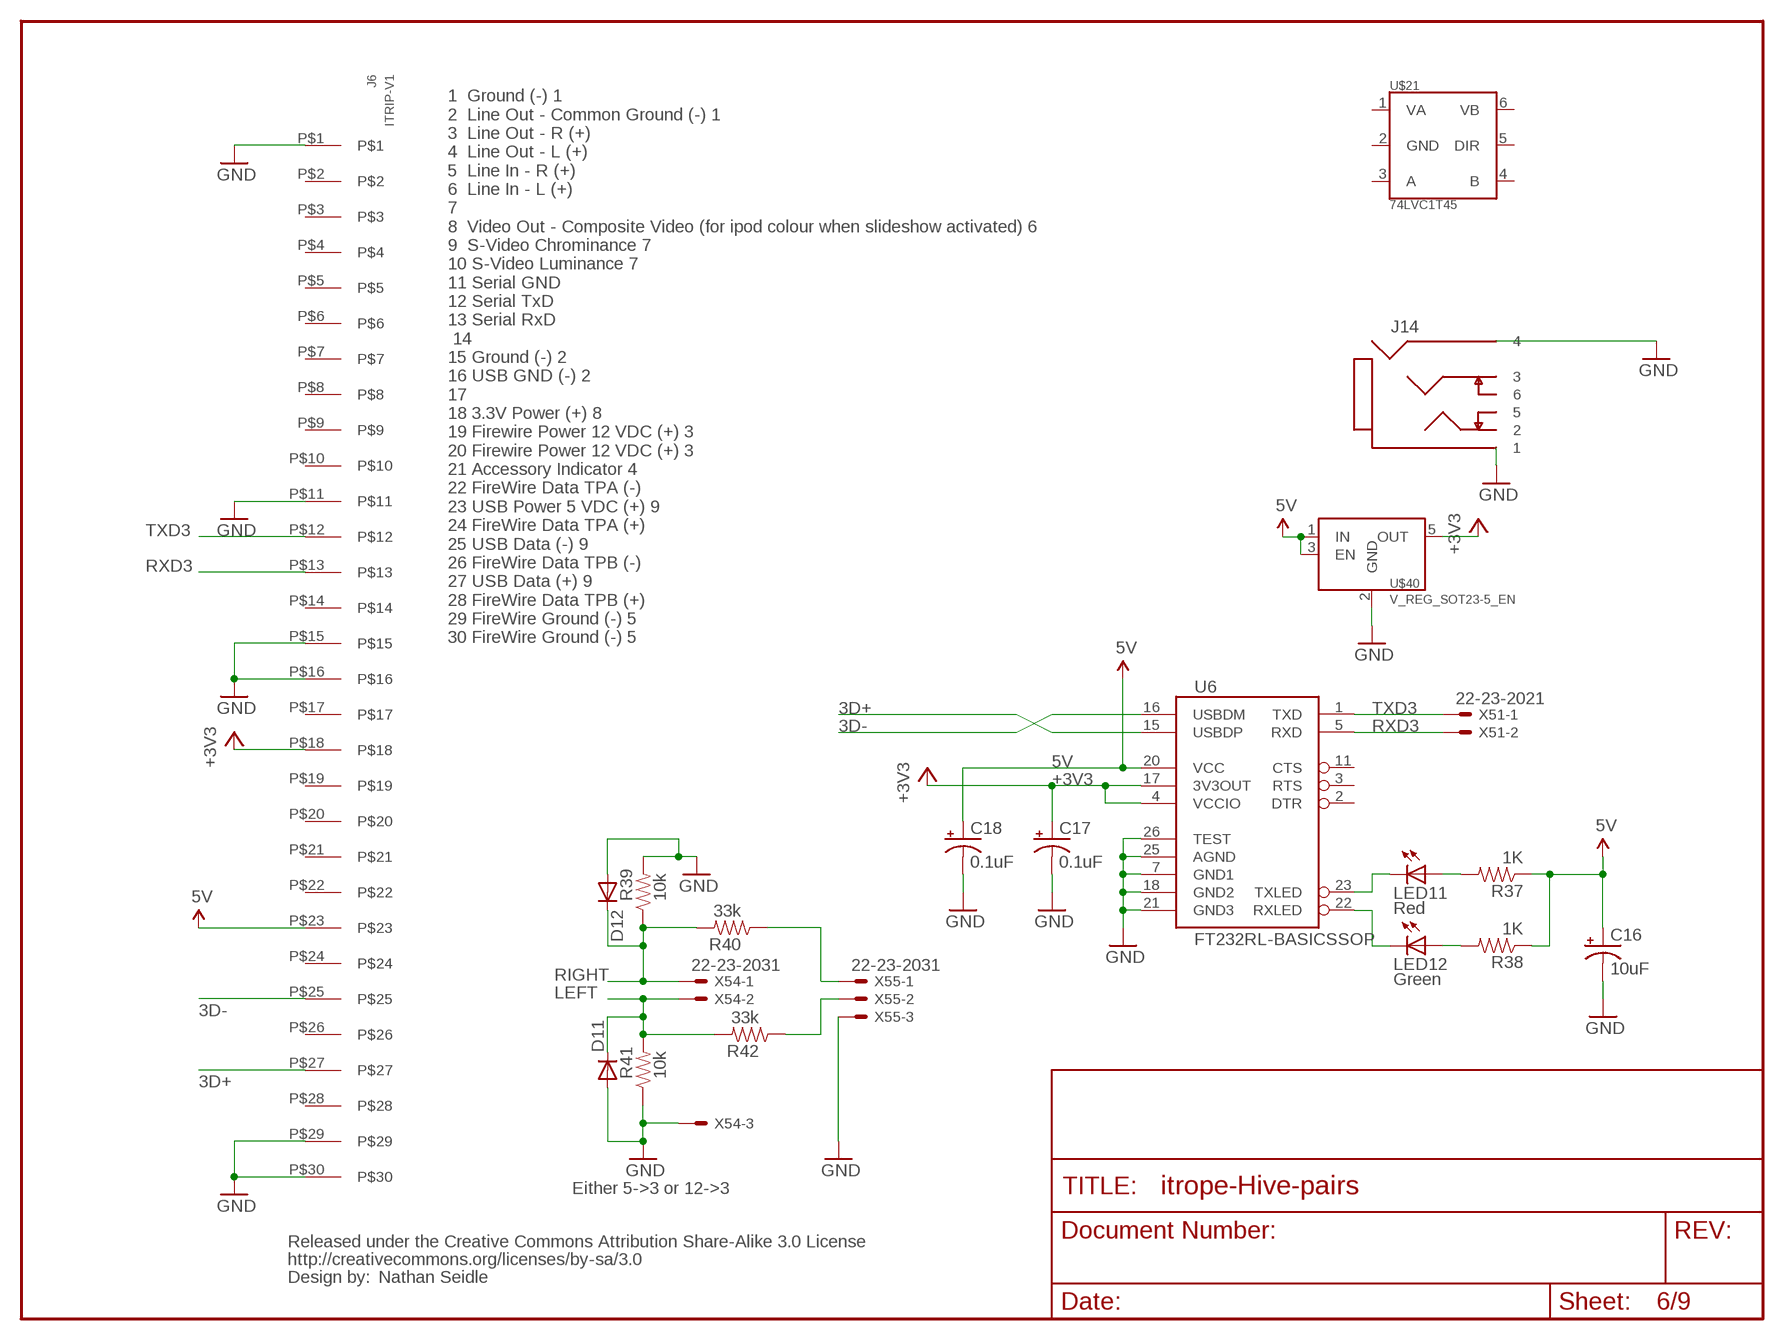
[diagram p5: schematic, sheet 6]

### Parts
C16  10uF  CPOL-USE2.5-5  [E2,5-5]
C17  0.1uF  CPOL-USE2.5-5  [E2,5-5]
C18  0.1uF  CPOL-USE2.5-5  [E2,5-5]
D11  DIODESOD  [SOD-323]
D12  DIODESOD  [SOD-323]
J6  ITRIP-V1  [30PINEDGE+ITRIP]
J14  JACK-PHONO-4COND-SW-C  [CUI-SJ-4351-CUSTOM]
LED11  Red  LED0603  [LED-0603]
LED12  Green  LED0603  [LED-0603]
R37  1K  RESISTOR0402  [C0402]
R38  1K  RESISTOR0402  [C0402]
R39  10k  RESISTOR0402  [C0402]
R40  33k  RESISTOR0402  [C0402]
R41  10k  RESISTOR0402  [C0402]
R42  33k  RESISTOR0402  [C0402]
U6  FT232RL-BASICSSOP  [SSOP28DB]
U$21  74LVC1T45  [SC70-6]
U$37  CREATIVE_COMMONS  [CREATIVE_COMMONS]
U$40  V_REG_SOT23-5_EN  [SOT23-5]
X51  22-23-2021  [22-23-2021]
X54  22-23-2031  [22-23-2031]
X55  22-23-2031  [22-23-2031]

### Nets
3D+: J6.P$27 U6.15(USBDP)
3D-: J6.P$25 U6.16(USBDM)
5V [vcc]: C16.+ C18.+ J6.P$23 R37.1 R38.1 U6.20(VCC) U$40.1(IN) U$40.3(EN) ; also sheet 1,2,3,4,5,7,8,9
+3V3: C17.+ J6.P$18 U6.4(VCCIO) U6.17(3V3OUT) U$40.5(OUT) ; also sheet 1,2,3,4,5,7,8,9
GND [vcc]: C16.- C17.- C18.- D11.2(A) D12.2(A) J6.P$1 J6.P$11 J6.P$15 J6.P$16 J6.P$29 J6.P$30 J14.1 J14.4 R39.2 R41.1 U6.7(GND1) U6.18(GND2) U6.21(GND3) U6.25(AGND) U6.26(TEST) U$40.2(GND) X54.3 X55.3 ; also sheet 1,2,3,4,5,7,8,9
LEFT: D11.1(C) R41.2 R42.2 X54.2 ; also sheet 1,2,3,4,5,7,8,9
N$28: LED11.A R37.2
N$29: LED12.A R38.2
N$30: R42.1 X55.2
N$31: R40.1 X55.1
RIGHT: D12.1(C) R39.1 R40.2 X54.1 ; also sheet 1,2,3,4,5,7,8,9
RXD3: J6.P$13 U6.5(RXD) X51.2 ; also sheet 7
RXLED5: LED12.C U6.22(RXLED)
TXD3: J6.P$12 U6.1(TXD) X51.1 ; also sheet 7
TXLED5: LED11.C U6.23(TXLED)
Unconnected: J6.P$2 J6.P$3 J6.P$4 J6.P$5 J6.P$6 J6.P$7 J6.P$8 J6.P$9 J6.P$10 J6.P$14 J6.P$17 J6.P$19 J6.P$20 J6.P$21 J6.P$22 J6.P$24 J6.P$26 J6.P$28 J14.2 J14.3 J14.5 J14.6 U6.2(DTR) U6.3(RTS) U6.11(CTS) U$21.1(VA) U$21.2(GND) U$21.3(A) U$21.4(B) U$21.5(DIR) U$21.6(VB)

### Notes on the sheet
- 1  Ground (-) 1
  2  Line Out - Common Ground (-) 1
  3  Line Out - R (+)
  4  Line Out - L (+)
  5  Line In - R (+)
  6  Line In - L (+)
  7
  8  Video Out - Composite Video (for ipod colour when slideshow activated) 6
  9  S-Video Chrominance 7
  10 S-Video Luminance 7
  11 Serial GND
  12 Serial TxD
  13 Serial RxD
   14
  15 Ground (-) 2
  16 USB GND (-) 2
  17
  18 3.3V Power (+) 8
  19 Firewire Power 12 VDC (+) 3
  20 Firewire Power 12 VDC (+) 3
  21 Accessory Indicator 4
  22 FireWire Data TPA (-)
  23 USB Power 5 VDC (+) 9
  24 FireWire Data TPA (+)
  25 USB Data (-) 9
  26 FireWire Data TPB (-)
  27 USB Data (+) 9
  28 FireWire Data TPB (+)
  29 FireWire Ground (-) 5
  30 FireWire Ground (-) 5
- Either 5->3 or 12->3
- Nathan Seidle

## Sheet 7 of 9
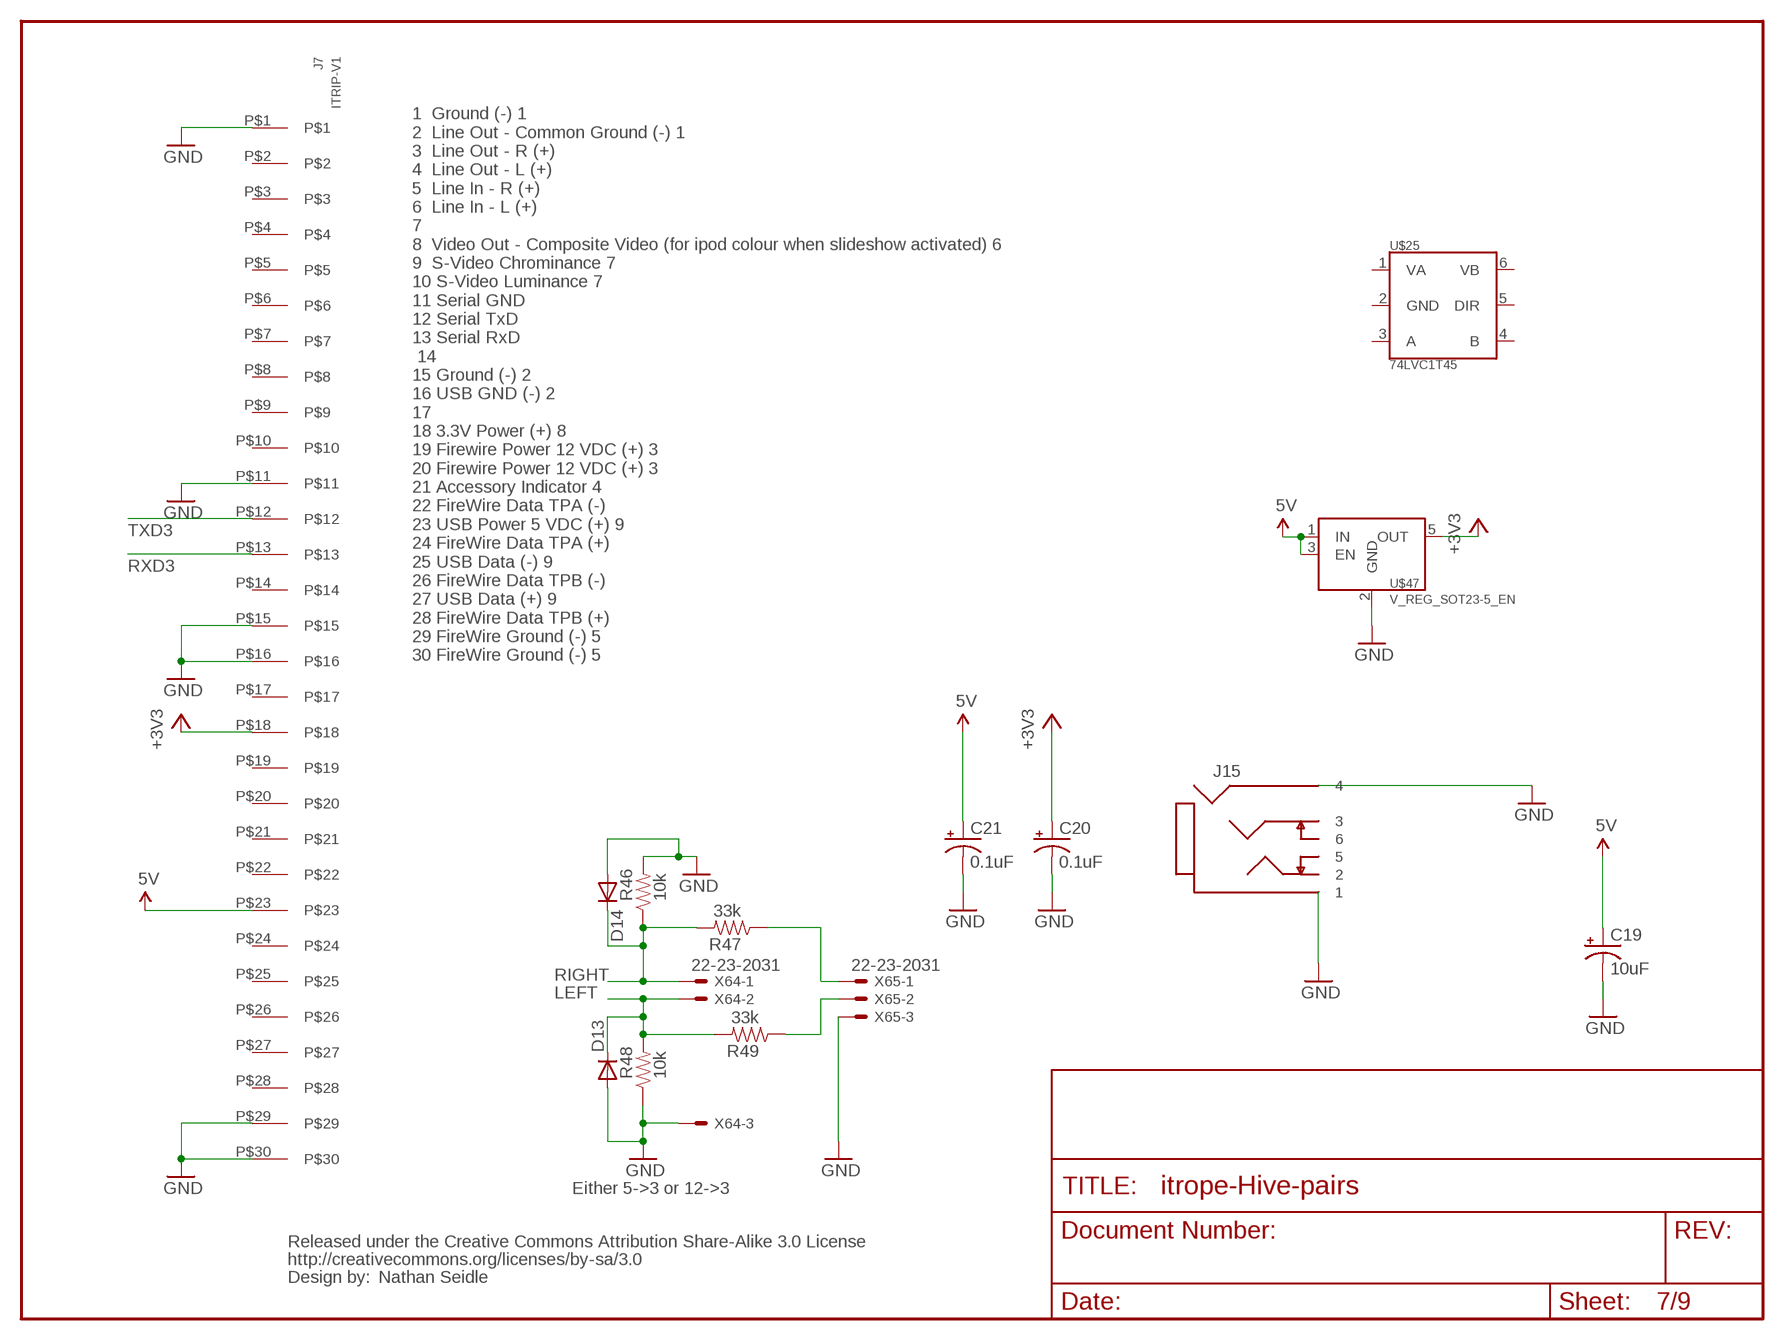
[diagram p6: schematic, sheet 7]

### Parts
C19  10uF  CPOL-USE2.5-5  [E2,5-5]
C20  0.1uF  CPOL-USE2.5-5  [E2,5-5]
C21  0.1uF  CPOL-USE2.5-5  [E2,5-5]
D13  DIODESOD  [SOD-323]
D14  DIODESOD  [SOD-323]
J7  ITRIP-V1  [30PINEDGE+ITRIP]
J15  JACK-PHONO-4COND-SW-C  [CUI-SJ-4351-CUSTOM]
R46  10k  RESISTOR0402  [C0402]
R47  33k  RESISTOR0402  [C0402]
R48  10k  RESISTOR0402  [C0402]
R49  33k  RESISTOR0402  [C0402]
U$25  74LVC1T45  [SC70-6]
U$44  CREATIVE_COMMONS  [CREATIVE_COMMONS]
U$47  V_REG_SOT23-5_EN  [SOT23-5]
X64  22-23-2031  [22-23-2031]
X65  22-23-2031  [22-23-2031]

### Nets
5V [vcc]: C19.+ C21.+ J7.P$23 U$47.1(IN) U$47.3(EN) ; also sheet 1,2,3,4,5,6,8,9
+3V3: C20.+ J7.P$18 U$47.5(OUT) ; also sheet 1,2,3,4,5,6,8,9
GND [vcc]: C19.- C20.- C21.- D13.2(A) D14.2(A) J7.P$1 J7.P$11 J7.P$15 J7.P$16 J7.P$29 J7.P$30 J15.1 J15.4 R46.2 R48.1 U$47.2(GND) X64.3 X65.3 ; also sheet 1,2,3,4,5,6,8,9
LEFT: D13.1(C) R48.2 R49.2 X64.2 ; also sheet 1,2,3,4,5,6,8,9
N$35: R49.1 X65.2
N$36: R47.1 X65.1
RIGHT: D14.1(C) R46.1 R47.2 X64.1 ; also sheet 1,2,3,4,5,6,8,9
RXD3: J7.P$13 ; also sheet 6
TXD3: J7.P$12 ; also sheet 6
Unconnected: J7.P$2 J7.P$3 J7.P$4 J7.P$5 J7.P$6 J7.P$7 J7.P$8 J7.P$9 J7.P$10 J7.P$14 J7.P$17 J7.P$19 J7.P$20 J7.P$21 J7.P$22 J7.P$24 J7.P$25 J7.P$26 J7.P$27 J7.P$28 J15.2 J15.3 J15.5 J15.6 U$25.1(VA) U$25.2(GND) U$25.3(A) U$25.4(B) U$25.5(DIR) U$25.6(VB)

### Notes on the sheet
- 1  Ground (-) 1
  2  Line Out - Common Ground (-) 1
  3  Line Out - R (+)
  4  Line Out - L (+)
  5  Line In - R (+)
  6  Line In - L (+)
  7
  8  Video Out - Composite Video (for ipod colour when slideshow activated) 6
  9  S-Video Chrominance 7
  10 S-Video Luminance 7
  11 Serial GND
  12 Serial TxD
  13 Serial RxD
   14
  15 Ground (-) 2
  16 USB GND (-) 2
  17
  18 3.3V Power (+) 8
  19 Firewire Power 12 VDC (+) 3
  20 Firewire Power 12 VDC (+) 3
  21 Accessory Indicator 4
  22 FireWire Data TPA (-)
  23 USB Power 5 VDC (+) 9
  24 FireWire Data TPA (+)
  25 USB Data (-) 9
  26 FireWire Data TPB (-)
  27 USB Data (+) 9
  28 FireWire Data TPB (+)
  29 FireWire Ground (-) 5
  30 FireWire Ground (-) 5
- Either 5->3 or 12->3
- Nathan Seidle

## Sheet 8 of 9
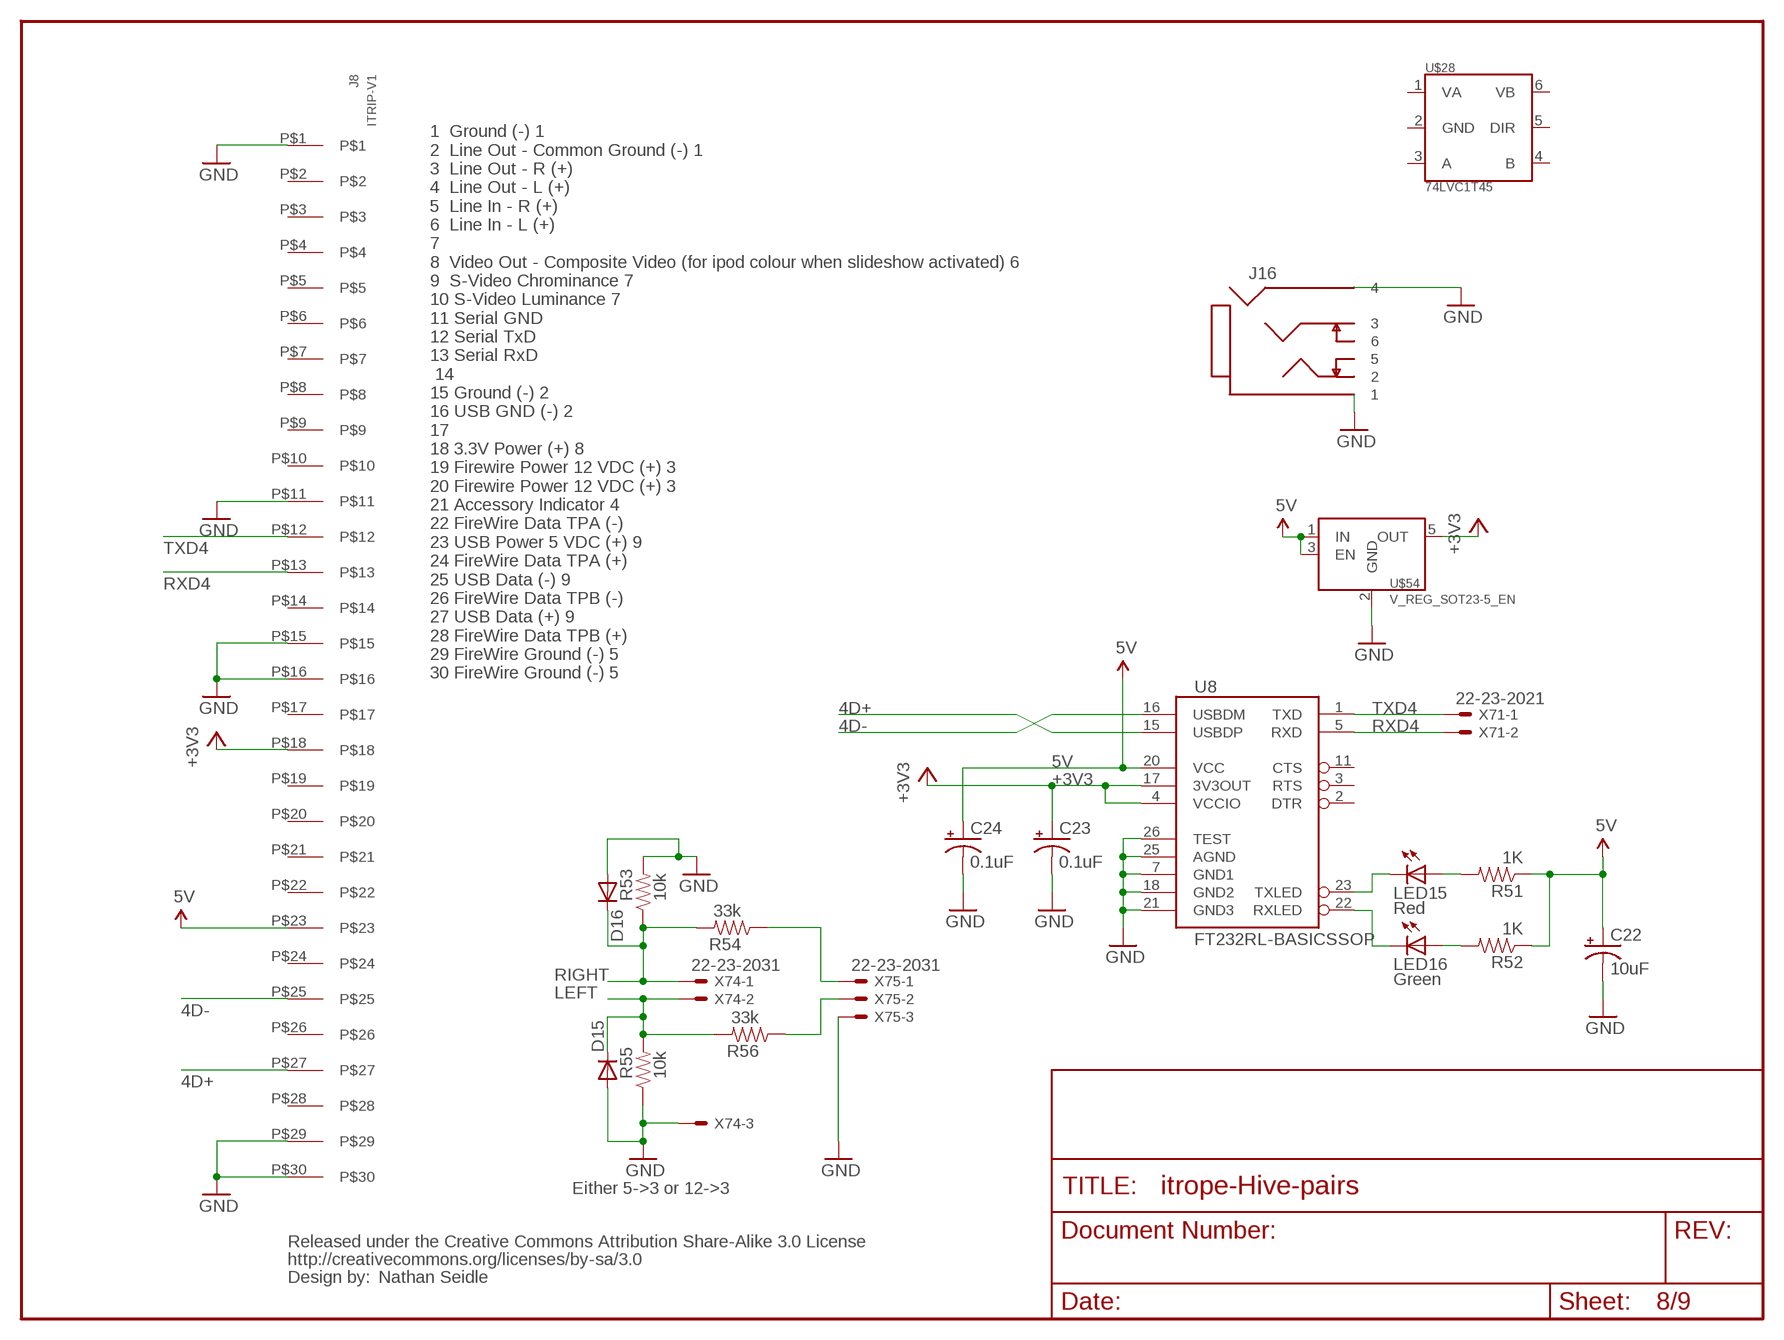
[diagram p7: schematic, sheet 8]

### Parts
C22  10uF  CPOL-USE2.5-5  [E2,5-5]
C23  0.1uF  CPOL-USE2.5-5  [E2,5-5]
C24  0.1uF  CPOL-USE2.5-5  [E2,5-5]
D15  DIODESOD  [SOD-323]
D16  DIODESOD  [SOD-323]
J8  ITRIP-V1  [30PINEDGE+ITRIP]
J16  JACK-PHONO-4COND-SW-C  [CUI-SJ-4351-CUSTOM]
LED15  Red  LED0603  [LED-0603]
LED16  Green  LED0603  [LED-0603]
R51  1K  RESISTOR0402  [C0402]
R52  1K  RESISTOR0402  [C0402]
R53  10k  RESISTOR0402  [C0402]
R54  33k  RESISTOR0402  [C0402]
R55  10k  RESISTOR0402  [C0402]
R56  33k  RESISTOR0402  [C0402]
U8  FT232RL-BASICSSOP  [SSOP28DB]
U$28  74LVC1T45  [SC70-6]
U$51  CREATIVE_COMMONS  [CREATIVE_COMMONS]
U$54  V_REG_SOT23-5_EN  [SOT23-5]
X71  22-23-2021  [22-23-2021]
X74  22-23-2031  [22-23-2031]
X75  22-23-2031  [22-23-2031]

### Nets
4D+: J8.P$27 U8.15(USBDP)
4D-: J8.P$25 U8.16(USBDM)
5V [vcc]: C22.+ C24.+ J8.P$23 R51.1 R52.1 U8.20(VCC) U$54.1(IN) U$54.3(EN) ; also sheet 1,2,3,4,5,6,7,9
+3V3: C23.+ J8.P$18 U8.4(VCCIO) U8.17(3V3OUT) U$54.5(OUT) ; also sheet 1,2,3,4,5,6,7,9
GND [vcc]: C22.- C23.- C24.- D15.2(A) D16.2(A) J8.P$1 J8.P$11 J8.P$15 J8.P$16 J8.P$29 J8.P$30 J16.1 J16.4 R53.2 R55.1 U8.7(GND1) U8.18(GND2) U8.21(GND3) U8.25(AGND) U8.26(TEST) U$54.2(GND) X74.3 X75.3 ; also sheet 1,2,3,4,5,6,7,9
LEFT: D15.1(C) R55.2 R56.2 X74.2 ; also sheet 1,2,3,4,5,6,7,9
N$38: LED15.A R51.2
N$39: LED16.A R52.2
N$40: R56.1 X75.2
N$41: R54.1 X75.1
RIGHT: D16.1(C) R53.1 R54.2 X74.1 ; also sheet 1,2,3,4,5,6,7,9
RXD4: J8.P$13 U8.5(RXD) X71.2 ; also sheet 9
RXLED7: LED16.C U8.22(RXLED)
TXD4: J8.P$12 U8.1(TXD) X71.1 ; also sheet 9
TXLED7: LED15.C U8.23(TXLED)
Unconnected: J8.P$2 J8.P$3 J8.P$4 J8.P$5 J8.P$6 J8.P$7 J8.P$8 J8.P$9 J8.P$10 J8.P$14 J8.P$17 J8.P$19 J8.P$20 J8.P$21 J8.P$22 J8.P$24 J8.P$26 J8.P$28 J16.2 J16.3 J16.5 J16.6 U8.2(DTR) U8.3(RTS) U8.11(CTS) U$28.1(VA) U$28.2(GND) U$28.3(A) U$28.4(B) U$28.5(DIR) U$28.6(VB)

### Notes on the sheet
- 1  Ground (-) 1
  2  Line Out - Common Ground (-) 1
  3  Line Out - R (+)
  4  Line Out - L (+)
  5  Line In - R (+)
  6  Line In - L (+)
  7
  8  Video Out - Composite Video (for ipod colour when slideshow activated) 6
  9  S-Video Chrominance 7
  10 S-Video Luminance 7
  11 Serial GND
  12 Serial TxD
  13 Serial RxD
   14
  15 Ground (-) 2
  16 USB GND (-) 2
  17
  18 3.3V Power (+) 8
  19 Firewire Power 12 VDC (+) 3
  20 Firewire Power 12 VDC (+) 3
  21 Accessory Indicator 4
  22 FireWire Data TPA (-)
  23 USB Power 5 VDC (+) 9
  24 FireWire Data TPA (+)
  25 USB Data (-) 9
  26 FireWire Data TPB (-)
  27 USB Data (+) 9
  28 FireWire Data TPB (+)
  29 FireWire Ground (-) 5
  30 FireWire Ground (-) 5
- Either 5->3 or 12->3
- Nathan Seidle

## Sheet 9 of 9
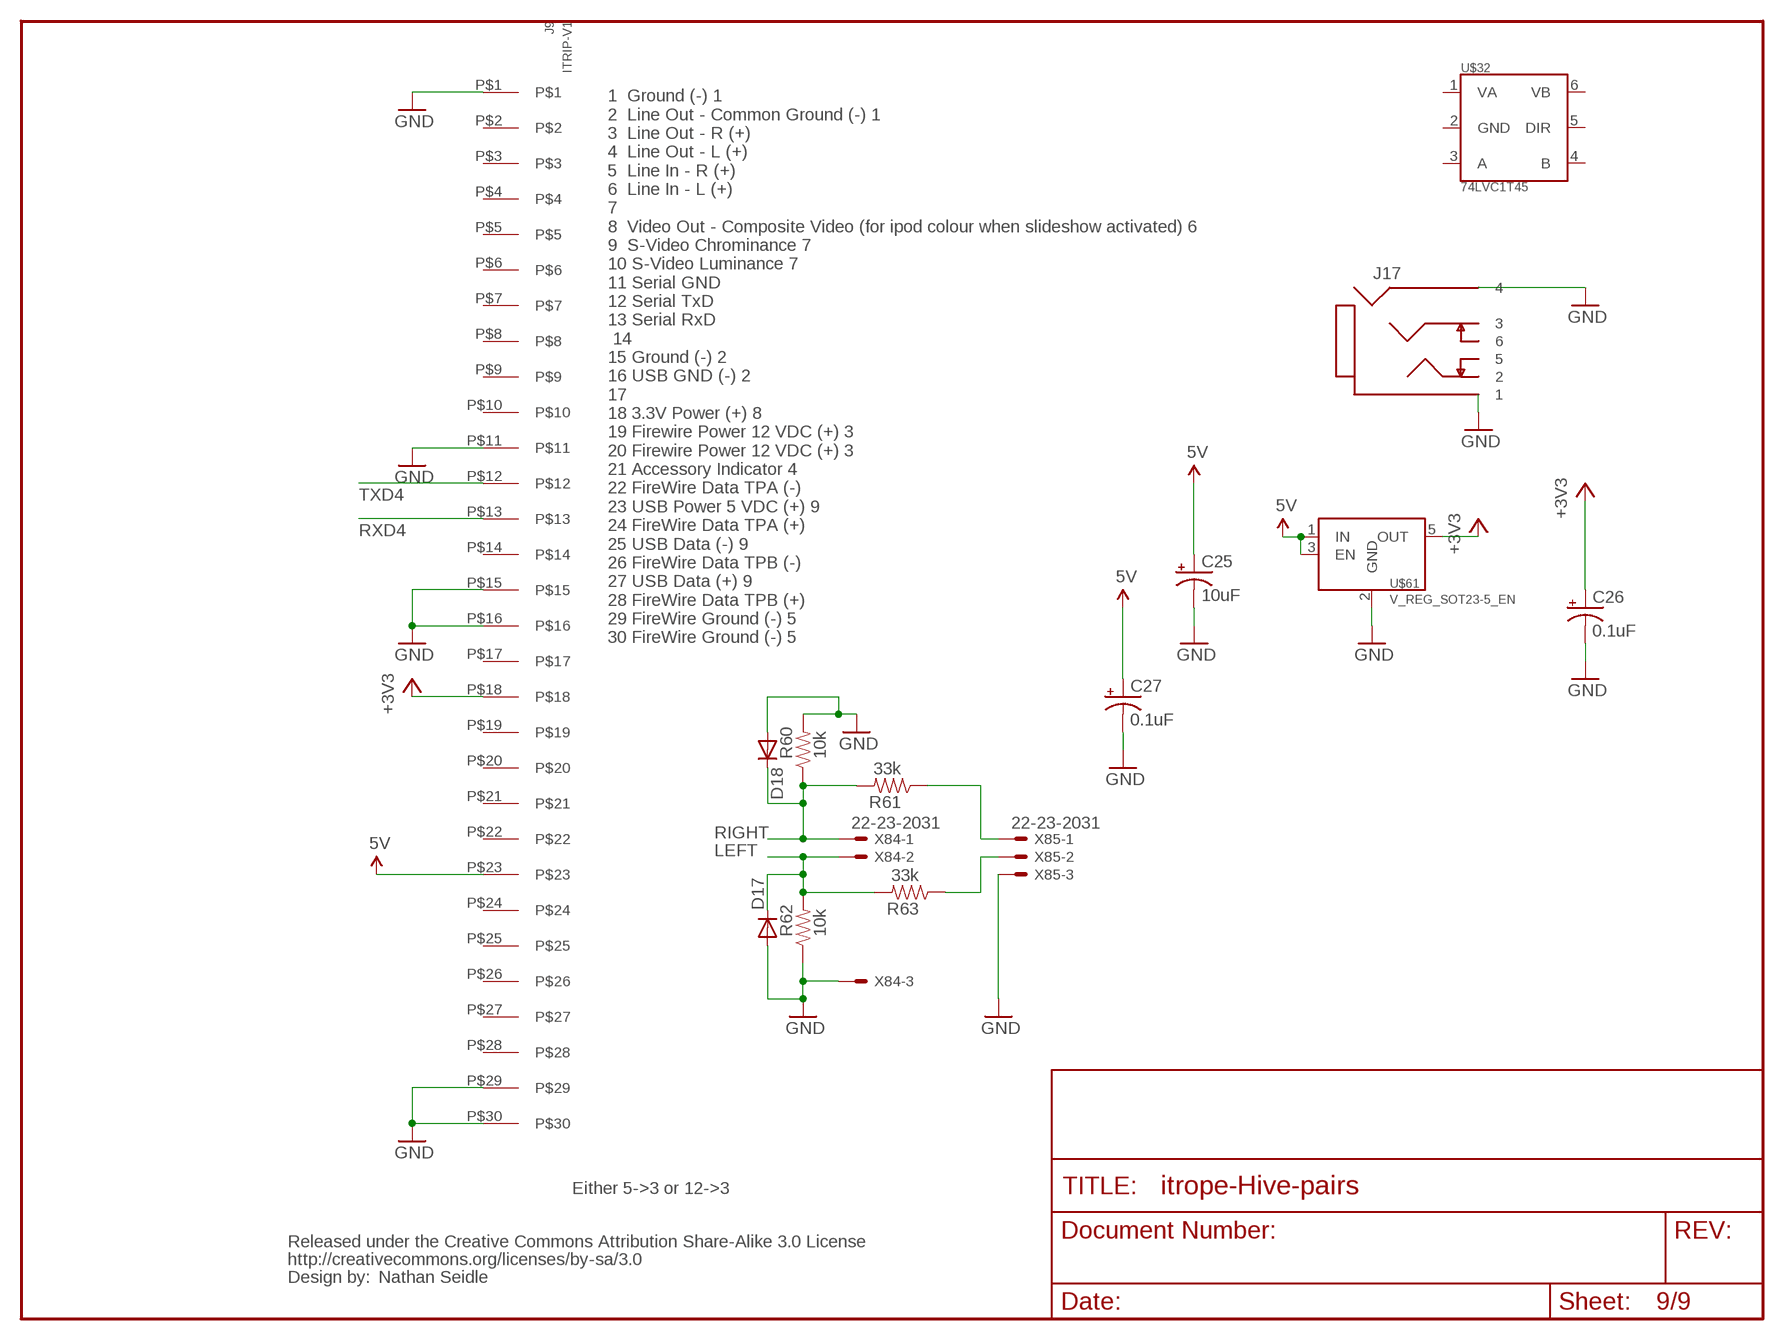
[diagram p8: schematic, sheet 9]

### Parts
C25  10uF  CPOL-USE2.5-5  [E2,5-5]
C26  0.1uF  CPOL-USE2.5-5  [E2,5-5]
C27  0.1uF  CPOL-USE2.5-5  [E2,5-5]
D17  DIODESOD  [SOD-323]
D18  DIODESOD  [SOD-323]
J9  ITRIP-V1  [30PINEDGE+ITRIP]
J17  JACK-PHONO-4COND-SW-C  [CUI-SJ-4351-CUSTOM]
R60  10k  RESISTOR0402  [C0402]
R61  33k  RESISTOR0402  [C0402]
R62  10k  RESISTOR0402  [C0402]
R63  33k  RESISTOR0402  [C0402]
U$32  74LVC1T45  [SC70-6]
U$58  CREATIVE_COMMONS  [CREATIVE_COMMONS]
U$61  V_REG_SOT23-5_EN  [SOT23-5]
X84  22-23-2031  [22-23-2031]
X85  22-23-2031  [22-23-2031]

### Nets
5V [vcc]: C25.+ C27.+ J9.P$23 U$61.1(IN) U$61.3(EN) ; also sheet 1,2,3,4,5,6,7,8
+3V3: C26.+ J9.P$18 U$61.5(OUT) ; also sheet 1,2,3,4,5,6,7,8
GND [vcc]: C25.- C26.- C27.- D17.2(A) D18.2(A) J9.P$1 J9.P$11 J9.P$15 J9.P$16 J9.P$29 J9.P$30 J17.1 J17.4 R60.2 R62.1 U$61.2(GND) X84.3 X85.3 ; also sheet 1,2,3,4,5,6,7,8
LEFT: D17.1(C) R62.2 R63.2 X84.2 ; also sheet 1,2,3,4,5,6,7,8
N$45: R63.1 X85.2
N$46: R61.1 X85.1
RIGHT: D18.1(C) R60.1 R61.2 X84.1 ; also sheet 1,2,3,4,5,6,7,8
RXD4: J9.P$13 ; also sheet 8
TXD4: J9.P$12 ; also sheet 8
Unconnected: J9.P$2 J9.P$3 J9.P$4 J9.P$5 J9.P$6 J9.P$7 J9.P$8 J9.P$9 J9.P$10 J9.P$14 J9.P$17 J9.P$19 J9.P$20 J9.P$21 J9.P$22 J9.P$24 J9.P$25 J9.P$26 J9.P$27 J9.P$28 J17.2 J17.3 J17.5 J17.6 U$32.1(VA) U$32.2(GND) U$32.3(A) U$32.4(B) U$32.5(DIR) U$32.6(VB)

### Notes on the sheet
- 1  Ground (-) 1
  2  Line Out - Common Ground (-) 1
  3  Line Out - R (+)
  4  Line Out - L (+)
  5  Line In - R (+)
  6  Line In - L (+)
  7
  8  Video Out - Composite Video (for ipod colour when slideshow activated) 6
  9  S-Video Chrominance 7
  10 S-Video Luminance 7
  11 Serial GND
  12 Serial TxD
  13 Serial RxD
   14
  15 Ground (-) 2
  16 USB GND (-) 2
  17
  18 3.3V Power (+) 8
  19 Firewire Power 12 VDC (+) 3
  20 Firewire Power 12 VDC (+) 3
  21 Accessory Indicator 4
  22 FireWire Data TPA (-)
  23 USB Power 5 VDC (+) 9
  24 FireWire Data TPA (+)
  25 USB Data (-) 9
  26 FireWire Data TPB (-)
  27 USB Data (+) 9
  28 FireWire Data TPB (+)
  29 FireWire Ground (-) 5
  30 FireWire Ground (-) 5
- Either 5->3 or 12->3
- Nathan Seidle

## Library data of the parts
C1-C27 = rcl:CPOL-US: POLARIZED CAPACITOR, American symbol
D1-D18 = LITTLEBITS:DIODE: Diode These are standard reverse protection diodes and small signal diodes. SMA package can handle up to about 1A. SOD-323 can handle about 200mA. What the SOD-323 package when ordering, there are some mfgs out there that are 5-pin packages.
J1-J9 = con-jae-IPOD-edgecard:ITRIP-V1
J10-J18 = LITTLEBITS:JACK-PHONO-4COND-SW
JP1 = LITTLEBITS:SLDR-JUMP-2
LED1-LED4 LED7 LED8 LED11 LED12 LED15 LED16 POWER = SparkFun:LED: LEDs Standard schematic elements and footprints for 5mm, 3mm, 1206, and 0603 sized LEDs. 5mm - Spark Fun Electronics SKU : COM-00529 (and others)
R1-R7 R9-R14 R18-R21 R23-R28 R32-R35 R37-R42 R46-R49 R51-R56 R60-R63 = SparkFun:RESISTOR: Resistor Basic schematic elements and footprints for 0603, 1206, and PTH 1/10th watt (small) resistors.
SW1 = LITTLEBITS:SWITCH-SLIDE-DP3T
U1 U2 U4 U6 U8 = SparkFun:FT232RL-BASIC: USB UART This is the simplified version of the FT232RL unit. Only what you need, nothing you don't. Spark Fun Electronics SKU : COM-00650
U3 = LITTLEBITS:74AHC1G125: Single bus buffer gate with 3-state output
U5 = LITTLEBITS:74HC125: Quad buffer/line driver; 3-state MPNs: 74HC125, 74HCT125 Digikey PN: 568-4995-5-ND
U$3 U$11 U$19 U$26 U$33 U$40 U$47 U$54 U$61 = LITTLEBITS:V_REG_SOT23-5_EN: Generic device for a SOT23-5 surface mount LDO voltage regulator
U$5 U$10 U$13 U$18 U$21 U$25 U$28 U$32 = LITTLEBITS:74LVC1T45
U$7 U$9 U$16 U$23 U$30 U$37 U$44 U$51 U$58 = SparkFun:CREATIVE_COMMONS
U$35 = LITTLEBITS:POT-SLIDE-30MM: Pot-Slide-30mm TT Elect. PS30-10PB10BR10K
X1-X4 X9 X11 X12 X31 X51 X71 = con-molex:22-23-2021: .100" (2.54mm) Center Header - 2 Pin; MF: MOLEX; MPN: 22-23-2021; OC_FARNELL: 1462926; OC_NEWARK: 25C3832
X5 X8 X10 = con-molex:87758-0216: 2 Pin - 2mm Dual Row Single Wafer, Vertical T/H HDR Source: http://www.molex.com/pdm_docs/sd/877580616_sd.pdf; MPN: 87758-0216; OC_FARNELL: unknown; OC_NEWARK: 94M1513
X6 X7 X14 X15 X24 X25 X34 X35 X44 X45 X54 X55 X64 X65 X74 X75 X84 X85 = con-molex:22-23-2031: .100" (2.54mm) Center Header - 3 Pin; MF: MOLEX; MPN: 22-23-2031; OC_FARNELL: 1462950; OC_NEWARK: 30C0862

## Net classes
1 vcc: width 0.203 mm

## Board
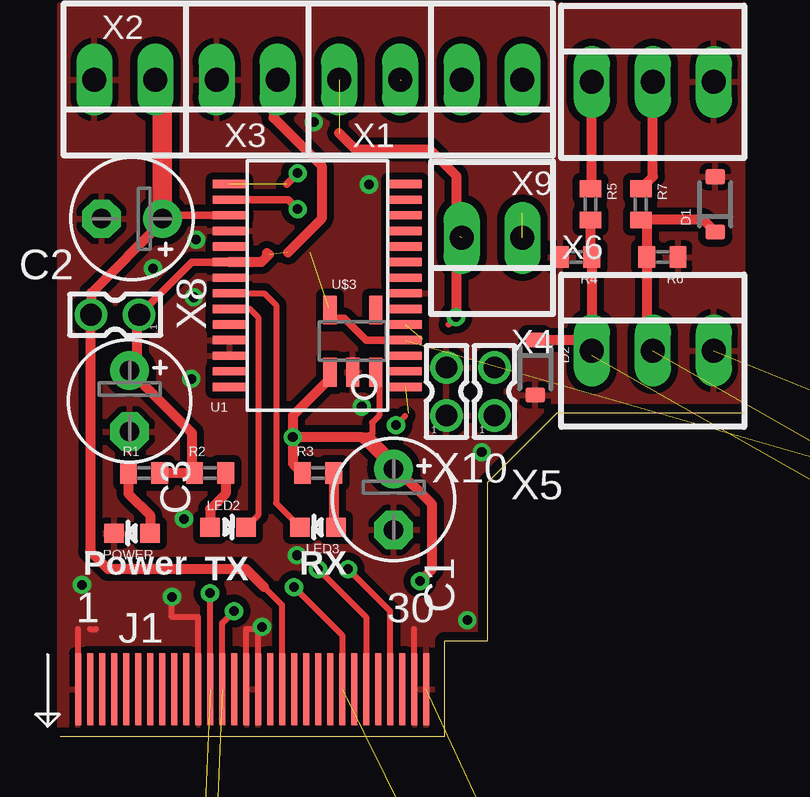
[diagram p9: board, top side]
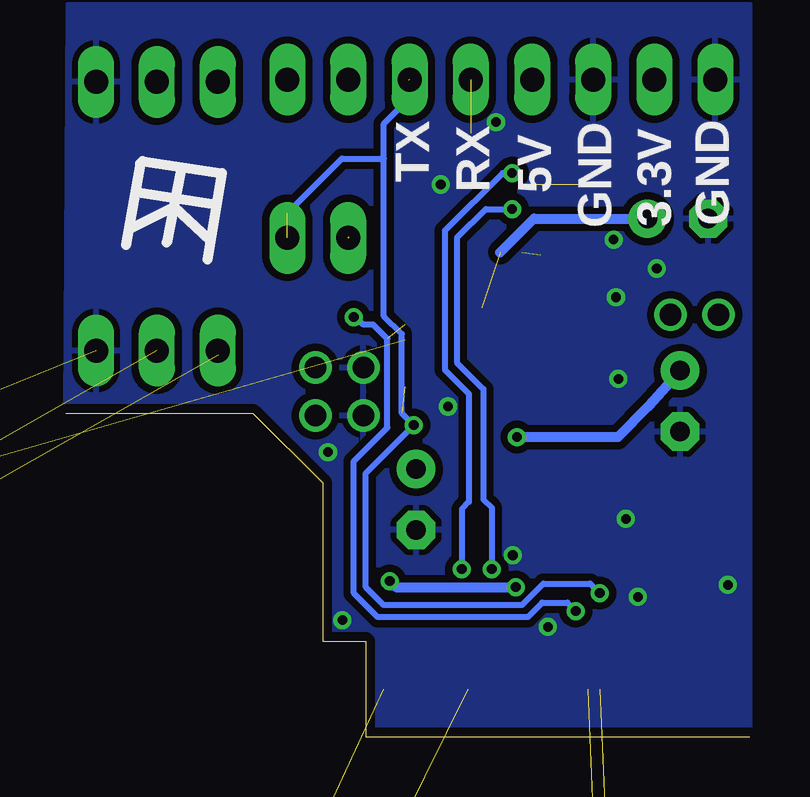
[diagram p10: board, bottom side, seen from below]

Size 28.5 x 13.48 mm. Coordinates in mm from the lower left corner, seen from the top.
Outline: 28.5,13.48 20.7,13.48 17.8,10.58 17.8,3.98 16,3.98 16,0 0,0
Copper layers (1*16): Top 0.0356mm / dielectric 1.5011mm / Bottom 0.0356mm
Design rules "LaenPCBOrder": minimum track width 6mil, minimum drill 13mil, track to track 6mil, track to pad 6mil, pad to pad 6mil, via to via 6mil, smd to smd 6mil, copper to edge 15mil, drill to drill 6mil, minimum pad ring 7mil, minimum via ring 7mil, stop-mask expansion 3mil, vias tented up to drill 0mil, thermal gap 10mil

### Footprints (pad centres in the part's own frame; a part is rotated, then mirrored left to right if it is on the bottom)
E2,5-5 = drill 0.813 pad 1.6: + -1.27,0 | drill 0.813 pad 1.6 octagon: - 1.27,0
SOD-323 = smd 0.63 x 0.83: 1 -1.15,0; 2 1.15,0
30PINEDGE+ITRIP = smd 0.25 x 3: P$1 7.25,1.5; P$2 6.75,1.5; P$3 6.25,1.5; P$4 5.75,1.5; P$5 5.25,1.5; P$6 4.75,1.5; P$7 4.25,1.5; P$8 3.75,1.5; P$9 3.25,1.5; P$10 2.75,1.5; P$11 2.25,1.5; P$12 1.75,1.5; P$13 1.25,1.5; P$14 0.75,1.5; P$15 0.25,1.5; P$16 -0.25,1.5; P$17 -0.75,1.5; P$18 -1.25,1.5; P$19 -1.75,1.5; P$20 -2.25,1.5; P$21 -2.75,1.5; P$22 -3.25,1.5; P$23 -3.75,1.5; P$24 -4.25,1.5; P$25 -4.75,1.5; P$26 -5.25,1.5; P$27 -5.75,1.5; P$28 -6.25,1.5; P$29 -6.75,1.5; P$30 -7.25,1.5
CUI-SJ-4351-CUSTOM = smd 1 x 1: 1 0.6,-3.7 | smd 2.8 x 2.8: 2 12.8,-3.7; 5 16.9,0.75 | smd 2.2 x 2.8: 3 5.3,3.7; 4 3.4,-3.7 | smd 2 x 2.8: 6 2.5,3.7 | hole 1.7: 4.5,0; 11.5,0
PAD-JUMPER-2-NO_YES_SILK = smd 0.635 x 1.27: 1 -0.45,0; 2 0.45,0
LED-0603 = smd 0.8 x 0.8: A 0,-0.75; C 0,0.75
C0402 = smd 0.7 x 0.9: 1 -0.65,0; 2 0.65,0
SWITCH-CK-AYZ0203 = smd 1 x 1.15: 1 -4,2.825; 2 -2,2.825; 3 4,2.825; 4 -4,-2.825; 5 -2,-2.825; 6 4,-2.825; C1 0,2.825; C2 0,-2.825 | hole 0.85: -2.25,0; 2.25,0
SSOP28DB = smd 0.348 x 1.397: 1 -4.225,-3.656; 2 -3.575,-3.656; 3 -2.925,-3.656; 4 -2.275,-3.656; 5 -1.625,-3.656; 6 -0.975,-3.656; 7 -0.325,-3.656; 8 0.325,-3.656; 9 0.975,-3.656; 10 1.625,-3.656; 11 2.275,-3.656; 12 2.925,-3.656; 13 3.575,-3.656; 14 4.225,-3.656; 15 4.225,3.656; 16 3.575,3.656; 17 2.925,3.656; 18 2.275,3.656; 19 1.625,3.656; 20 0.975,3.656; 21 0.325,3.656; 22 -0.325,3.656; 23 -0.975,3.656; 24 -1.625,3.656; 25 -2.275,3.656; 26 -2.925,3.656; 27 -3.575,3.656; 28 -4.225,3.656
SOT23-5 = smd 0.55 x 1.2: 1 -0.95,-1.3; 2 0,-1.3; 3 0.95,-1.3; 4 0.95,1.3; 5 -0.95,1.3
SOIC14 = smd 0.58 x 1.18: 1 -3.81,-2.66; 2 -2.54,-2.66; 3 -1.27,-2.66; 4 0,-2.66; 5 1.27,-2.66; 6 2.54,-2.66; 7 3.81,-2.66; 8 3.81,2.66; 9 2.54,2.66; 10 1.27,2.66; 11 0,2.66; 12 -1.27,2.66; 13 -2.54,2.66; 14 -3.81,2.66
SC70-6 = smd 0.4 x 0.85: 1 -0.65,-0.9; 2 0,-0.9; 3 0.65,-0.9; 4 0.65,0.9; 5 0,0.9; 6 -0.65,0.9
POT-SLIDE-30MM = drill 1.2: 1 0,6; 2 0,2.5; 3 44,6 | drill 1.7: P$4 6,8.5; P$5 4.5,0; P$6 40,0; P$7 38.5,8.5
22-23-2021 = drill 1 long: 1 -1.27,0; 2 1.27,0
87758-0216 = drill 0.9 pad 1.27: 1 0,-1; 2 0,1
22-23-2031 = drill 1 long: 1 -2.54,0; 2 0,0; 3 2.54,0

### Placement (x,y rotation side)
C1  13.9,9.88 270 top
C2  3,21.58 180 top  (outside the outline)
C3  2.9,13.98 270 top
C4  80.7,2.48 180 top  (outside the outline)
C5  62.1,2.48 180 top  (outside the outline)
C6  28.3,-28.92 0 top  (outside the outline)
C7  148,-111.72 180 top  (outside the outline)
C8  129.4,-111.72 180 top  (outside the outline)
C9  218,2.68 180 top  (outside the outline)
C10  252.8,-213.32 180 top  (outside the outline)
C11  234.2,-213.32 180 top  (outside the outline)
C12  322.8,-98.92 180 top  (outside the outline)
C13  362,-320.22 180 top  (outside the outline)
C14  343.4,-320.22 180 top  (outside the outline)
C15  432,-205.82 180 top  (outside the outline)
C16  471,-428.12 180 top  (outside the outline)
C17  452.4,-428.12 180 top  (outside the outline)
C18  541,-313.72 180 top  (outside the outline)
C19  586.7,-531.82 180 top  (outside the outline)
C20  568.1,-531.82 180 top  (outside the outline)
C21  656.7,-417.42 180 top  (outside the outline)
C22  731.9,-626.72 0 top  (outside the outline)
C23  750.5,-626.72 0 top  (outside the outline)
C24  661.9,-512.42 0 top  (outside the outline)
C25  824.5,-701.92 0 top  (outside the outline)
C26  843.1,-701.92 0 top  (outside the outline)
C27  754.5,-587.52 0 top  (outside the outline)
D1  27.3,22.18 90 top  (outside the outline)
D2  19.8,15.38 270 top
D3  52,-72.92 0 top  (outside the outline)
D4  55.1,-72.92 0 top  (outside the outline)
D5  194.3,46.68 180 top  (outside the outline)
D6  191.2,46.68 180 top  (outside the outline)
D7  299.1,-54.92 180 top  (outside the outline)
D8  296,-54.92 180 top  (outside the outline)
D9  408.3,-161.82 180 top  (outside the outline)
D10  405.2,-161.82 180 top  (outside the outline)
D11  517.3,-269.72 180 top  (outside the outline)
D12  514.2,-269.72 180 top  (outside the outline)
D13  633,-373.42 180 top  (outside the outline)
D14  629.9,-373.42 180 top  (outside the outline)
D15  778.2,-715.22 0 top  (outside the outline)
D16  781.3,-715.22 0 top  (outside the outline)
D17  778.2,-543.62 0 top  (outside the outline)
D18  781.3,-543.62 0 top  (outside the outline)
J1  8,3.48 180 top
J2  64.2,-50.02 180 top  (outside the outline)
J3  178.3,-92.92 180 top  (outside the outline)
J4  283.1,-194.52 180 top  (outside the outline)
J5  392.3,-301.42 180 top  (outside the outline)
J6  501.3,-409.32 180 top  (outside the outline)
J7  617,-513.02 180 top  (outside the outline)
J8  701.6,-547.32 0 top  (outside the outline)
J9  794.2,-622.42 0 top  (outside the outline)
J10  158.5,-167.42 0 top  (outside the outline)
J11  158.5,-184.22 0 top  (outside the outline)
J12  158.5,-201.02 0 top  (outside the outline)
J13  158.5,-217.82 0 top  (outside the outline)
J14  158.5,-234.62 0 top  (outside the outline)
J15  158.5,-251.42 0 top  (outside the outline)
J16  158.5,-268.22 0 top  (outside the outline)
J17  158.5,-285.02 0 top  (outside the outline)
J18  158.5,-301.82 0 top  (outside the outline)
JP1  -27.4,-723.92 0 top  (outside the outline)
LED1  58,-72.62 0 top  (outside the outline)
LED2  7,8.73 270 top
LED3  10.75,8.73 90 top
LED4  61,-72.62 0 top  (outside the outline)
LED7  293.1,-55.22 180 top  (outside the outline)
LED8  290.1,-55.22 180 top  (outside the outline)
LED11  511.3,-270.02 180 top  (outside the outline)
LED12  508.3,-270.02 180 top  (outside the outline)
LED15  784.2,-715.12 0 top  (outside the outline)
LED16  787.2,-715.12 0 top  (outside the outline)
POWER  3,8.48 90 top
R1  3.5,10.98 0 top
R2  6.25,10.98 0 top
R3  10.75,10.98 0 top
R4  21.5,19.98 180 top  (outside the outline)
R5  22.1,22.18 270 top  (outside the outline)
R6  25.1,19.98 180 top  (outside the outline)
R7  24.2,22.18 270 top  (outside the outline)
R9  30.4,-72.92 0 top  (outside the outline)
R10  33.5,-72.92 0 top  (outside the outline)
R11  36.6,-72.92 0 top  (outside the outline)
R12  39.7,-72.92 0 top  (outside the outline)
R13  42.8,-72.92 0 top  (outside the outline)
R14  45.9,-72.92 0 top  (outside the outline)
R18  209.7,46.68 180 top  (outside the outline)
R19  206.6,46.68 180 top  (outside the outline)
R20  203.5,46.68 180 top  (outside the outline)
R21  200.4,46.68 180 top  (outside the outline)
R23  320.7,-54.92 180 top  (outside the outline)
R24  317.6,-54.92 180 top  (outside the outline)
R25  314.5,-54.92 180 top  (outside the outline)
R26  311.4,-54.92 180 top  (outside the outline)
R27  308.3,-54.92 180 top  (outside the outline)
R28  305.2,-54.92 180 top  (outside the outline)
R32  423.7,-161.82 180 top  (outside the outline)
R33  420.6,-161.82 180 top  (outside the outline)
R34  417.5,-161.82 180 top  (outside the outline)
R35  414.4,-161.82 180 top  (outside the outline)
R37  538.9,-269.72 180 top  (outside the outline)
R38  535.8,-269.72 180 top  (outside the outline)
R39  532.7,-269.72 180 top  (outside the outline)
R40  529.6,-269.72 180 top  (outside the outline)
R41  526.5,-269.72 180 top  (outside the outline)
R42  523.4,-269.72 180 top  (outside the outline)
R46  648.4,-373.42 180 top  (outside the outline)
R47  645.3,-373.42 180 top  (outside the outline)
R48  642.2,-373.42 180 top  (outside the outline)
R49  639.1,-373.42 180 top  (outside the outline)
R51  756.6,-714.92 0 top  (outside the outline)
R52  759.7,-714.92 0 top  (outside the outline)
R53  762.8,-714.92 0 top  (outside the outline)
R54  765.9,-714.92 0 top  (outside the outline)
R55  769,-714.92 0 top  (outside the outline)
R56  772.1,-714.92 0 top  (outside the outline)
R60  762.8,-543.32 0 top  (outside the outline)
R61  765.9,-543.32 0 top  (outside the outline)
R62  769,-543.32 0 top  (outside the outline)
R63  772.1,-543.32 0 top  (outside the outline)
SW1  -20.9,-721.42 0 top  (outside the outline)
U1  10.72,18.8 90 top
U2  24.3,-57.42 0 top  (outside the outline)
U3  -53.5,-766.12 0 top  (outside the outline)
U4  326.8,-70.42 180 top  (outside the outline)
U5  -48.4,-774.12 0 top  (outside the outline)
U6  545,-285.22 180 top  (outside the outline)
U8  657.9,-483.92 0 top  (outside the outline)
U$3  12.2,16.48 0 top
U$5  -30.3,-723.82 0 top  (outside the outline)
U$7  40,-70.32 0 top  (outside the outline)
U$9  61.88,-77.88 180 top  (outside the outline)
U$10  -33.2,-723.82 0 top  (outside the outline)
U$11  20.5,-74.72 0 top  (outside the outline)
U$13  -36.1,-723.82 0 top  (outside the outline)
U$16  206.3,44.08 180 top  (outside the outline)
U$18  -39,-723.82 0 top  (outside the outline)
U$19  225.8,48.48 180 top  (outside the outline)
U$21  -41.9,-723.82 0 top  (outside the outline)
U$23  311.1,-57.52 180 top  (outside the outline)
U$25  -44.8,-723.82 0 top  (outside the outline)
U$26  330.6,-53.12 180 top  (outside the outline)
U$28  -47.7,-723.82 0 top  (outside the outline)
U$30  420.3,-164.42 180 top  (outside the outline)
U$32  -50.6,-723.82 0 top  (outside the outline)
U$33  439.8,-160.02 180 top  (outside the outline)
U$35  -43,-756.72 0 top  (outside the outline)
U$37  529.3,-272.32 180 top  (outside the outline)
U$40  548.8,-267.92 180 top  (outside the outline)
U$44  645,-376.02 180 top  (outside the outline)
U$47  664.5,-371.62 180 top  (outside the outline)
U$51  673.6,-477.42 0 top  (outside the outline)
U$54  746.7,-713.32 0 top  (outside the outline)
U$58  766.2,-552.52 0 top  (outside the outline)
U$61  746.7,-541.72 0 top  (outside the outline)
X1  12.9,27.38 180 top  (outside the outline)
X2  2.7,27.38 180 top  (outside the outline)
X3  7.8,27.38 180 top  (outside the outline)
X4  18,20.78 180 top  (outside the outline)
X5  18.1,14.38 0 top
X6  24.7,16.08 0 top
X7  24.7,27.28 0 top  (outside the outline)
X8  2.3,17.58 90 top  (outside the outline)
X9  18,27.38 180 top  (outside the outline)
X10  16.1,14.38 0 top
X11  27.8,-44.52 0 top  (outside the outline)
X12  150.1,-19.22 0 top  (outside the outline)
X14  102.6,-28.32 0 top  (outside the outline)
X15  122.7,-28.32 0 top  (outside the outline)
X24  143.7,2.08 180 top  (outside the outline)
X25  123.6,2.08 180 top  (outside the outline)
X31  323.3,-83.32 180 top  (outside the outline)
X34  248.5,-99.52 180 top  (outside the outline)
X35  228.4,-99.52 180 top  (outside the outline)
X44  357.7,-206.42 180 top  (outside the outline)
X45  337.6,-206.42 180 top  (outside the outline)
X51  541.5,-298.12 180 top  (outside the outline)
X54  466.7,-314.32 180 top  (outside the outline)
X55  446.6,-314.32 180 top  (outside the outline)
X64  582.4,-418.02 180 top  (outside the outline)
X65  562.3,-418.02 180 top  (outside the outline)
X71  661.4,-496.82 0 top  (outside the outline)
X74  736.2,-513.02 0 top  (outside the outline)
X75  756.3,-513.02 0 top  (outside the outline)
X84  828.8,-588.12 0 top  (outside the outline)
X85  916.7,-667.52 0 top  (outside the outline)

### Tracks (layer width: path | path; a pad name or v marks a point on that pad's centre or on a via)
1D+  (1 unrouted)
1D-  (1 unrouted)
2D+  (1 unrouted)
2D-  (1 unrouted)
3D+  (1 unrouted)
3D-  (1 unrouted)
4D+  (1 unrouted)
4D-  (1 unrouted)
5V  (via drill 0.4)  (53 unrouted)
  Top 0.254: 10.09,11.18 R3.1 | v9.75,6.23 11.75,4.23 J1.P$23 | 13.9,11.3 13.9,11.18 C1.+ 13,12.05 | U$3.3 13.05,15.18 13.3,14.93 13.3,13.38 13,13.08 13,12.58 12.9,12.48
  Top 0.305: U1.20 5.49,19.77 X8.1
  Top 0.406: v15,6.48 15.5,6.98 15.5,9.67 14.02,11.15 C1.+ 12.57,12.48 | 4,11.13 R1.2 R2.1 5.5,11.08 5.5,12.65 C3.+ 3.2,15.55 3.2,17.48 X8.1 | 10,11.08 R3.1 9.7,11.38 v9.7,12.48 | 12.57,12.48 v9.7,12.48 | U1.20 8.39,19.77 8.7,20.08 8.63,20.15 | 12.57,12.48 12.9,12.48 13.7,11.68 13.7,11.48 14,11.18 13.9,11.18 | U$3.1 11.25,14.93 9.7,13.38 v9.7,12.48 | X3.1 8.9,27.38 8.9,25.78 10.9,23.78 10.9,21.58 9.5,20.18
  Bottom 0.406: v9.7,12.48 5.5,12.48 4.2,13.78 C3.+ | v15,6.48 14.75,6.23 v9.75,6.23
+3V3  (33 unrouted)
  Top 0.254: J1.P$18 9.25,5.48 8.5,6.23
  Top 0.305: U1.4 12.76,16.52 11.85,17.43 11.25,17.43 U$3.5 | 4.63,21.72 4.49,21.58 C2.+ 4.41,21.72 U1.17
  Top 0.406: 8.5,6.23 7.75,6.98 2,6.98 1.25,7.73 1.25,17.53 X8.2 1.3,18.48 4.27,21.45 C2.+ | U$3.5 11.17,17.86
  Top 0.813: X2.1 4.27,27.08 C2.+
  Bottom 0.254: 4.37,21.68 C2.+
  Bottom 0.406: 10.4,20.18 9,21.58 C2.+
COD+  (via drill 0.4)  (1 unrouted)
  Top 0.254: J1.P$27 13.75,5.23 v12,6.98
  Top 0.305: v9.9,23.48 9.44,23.02
  Bottom 0.254: v9.9,23.48 10.3,23.48 12.7,21.08 12.7,15.28 11.7,14.28 11.7,9.78 12,9.48 v12,6.98
COD-  (via drill 0.4)
  Top 0.254: v10.75,6.98 12.75,4.98 J1.P$25
  Top 0.305: v9.9,21.98 9.51,22.37 U1.16
  Bottom 0.254: v9.9,21.98 11,21.98 12.2,20.78 12.2,15.58 11.1,14.48 11.1,9.88 10.75,9.53 v10.75,6.98
GND  (via drill 0.4)  (166 unrouted)
  Top 0.254: 14.32,18.41 U1.7 | 1.25,4.48 1.5,4.48 | J1.P$29 14.75,4.48 | J1.P$16 8.25,4.48 7.75,4.48 J1.P$15 | J1.P$11 5.75,4.98 4.66,4.98 v4.66,5.83 | J1.P$1 0.75,4.48
  other vias: 0.91,6.33 5.16,9.08 8.41,4.58 5.47,14.91 3.87,19.51 5.67,20.71 5.57,18.31 12.87,23.01 10.57,25.61 12.57,13.76 9.87,7.56 17.57,11.86 16.97,4.86
  pour Top (isolate 0.3): 0,30.48 28.4,30.48 28.45,13.43 22.55,13.43 19.7,10.58 19.7,3.98 16.1,3.98 16.1,0 0,0
  pour Bottom (isolate 0.305): 0,30.48 28.4,30.48 28.5,13.48 22.6,13.48 19.7,10.58 19.7,3.98 16.1,3.98 16.1,0 0,0
LEFT  (32 unrouted)
  Top 0.406: X6.2 24.45,16.13 R6.2 24.45,21.28 R7.2 26.8,21.53 D1.1
N$1
  Top 0.254: POWER.A 3.87,8.64 3.75,8.75
  Top 0.406: R1.1 2.85,10.13 3.75,9.23 POWER.A
N$2
  Top 0.406: R7.1 24.7,23.33 X7.2
N$3
  Top 0.406: R2.2 6.9,10.13 6.25,9.48 LED2.A
N$4
  Top 0.406: R3.2 11.4,8.83 LED3.A
N$5
  Top 0.406: R5.1 22.16,22.89 X7.1
N$8  (1 unrouted)
N$9  (1 unrouted)
N$10  (1 unrouted)
N$11  (1 unrouted)
N$15  (1 unrouted)
N$16  (1 unrouted)
N$18  (1 unrouted)
N$19  (1 unrouted)
N$20  (1 unrouted)
N$21  (1 unrouted)
N$25  (1 unrouted)
N$26  (1 unrouted)
N$28  (1 unrouted)
N$29  (1 unrouted)
N$30  (1 unrouted)
N$31  (1 unrouted)
N$35  (1 unrouted)
N$36  (1 unrouted)
N$38  (1 unrouted)
N$39  (1 unrouted)
N$40  (1 unrouted)
N$41  (1 unrouted)
N$45  (1 unrouted)
N$46  (1 unrouted)
RIGHT  (32 unrouted)
  Top 0.305: 22.05,16.53 22.1,16.58
  Top 0.406: 22.1,16.88 22.1,16.58 22.1,15.94 X6.1 | R5.2 22.1,20.03 R4.1 22.15,15.89 X6.1 | D2.1 21.51,16.53 X6.1
RXD1  (4 unrouted)
RXD2  (3 unrouted)
RXD3  (3 unrouted)
RXD4  (3 unrouted)
RXLED
  Top 0.254: U1.22 8.51,18.47 9,17.98 9,9.73 LED3.C
RXLED1  (1 unrouted)
RXLED3  (1 unrouted)
RXLED5  (1 unrouted)
RXLED7  (1 unrouted)
TX_FROM_CO  (via drill 0.4)  (4 unrouted)
  Top 0.254: v16.5,17.48 16.19,17.17 | J1.P$13 6.75,4.73 v7.25,5.23
  Top 0.406: 16.5,20.78 16.5,23.38 15.4,24.48 12.3,24.48 11.63,25.15 | 16.5,20.78 v16.5,17.48 | 16.62,20.91 16.55,20.83 | 16.55,20.83 16.5,20.78 | 16.68,20.83 16.55,20.83
  Bottom 0.254: v7.25,5.23 7.6,5.58 8.65,5.58 9.25,4.98 15.5,4.98 16.5,5.98 16.5,11.48 15.1,12.88 15.1,16.58 15.69,17.17 16.1,17.17 16.41,17.48 v16.5,17.48
TX_TO_CO  (via drill 0.4)  (4 unrouted)
  Top 0.254: v14,12.98 14.38,13.36 | J1.P$12 v6.25,5.98
  Bottom 0.254: v6.25,5.98 6.65,6.38 8.6,6.38 9.5,5.48 15.25,5.48 16,6.23 16,10.98 v14,12.98 14.5,13.48 14.5,16.78 15.24,17.52 15.24,24.08 | 15.24,24.08 15.24,25.54 14.2,26.58 14.2,27.35 | 19.27,21.81 17,24.08 15.24,24.08
TXD1  (4 unrouted)
TXD2  (3 unrouted)
TXD3  (3 unrouted)
TXD4  (3 unrouted)
TXLED
  Top 0.254: U1.23 7.91,17.82 8.25,17.48 8.25,9.23 LED2.C
TXLED1  (1 unrouted)
TXLED3  (1 unrouted)
TXLED5  (1 unrouted)
TXLED7  (1 unrouted)

### Text on the board
tPlace: TX | Power | RX
bPlace: GND | 3.3V | GND | 5V | RX | TX
Measures: R | L